# EasyEDA Pro project ProPrj_PA_SWITCH_V4_2026-02-15.epro

# Schematic Main_Schematic

## Sheets
1 MCU_POWER: Board Name: MAIN_PANEL; Create Date: 2025-02-24; Page Name: MCU_POWER; Project Name: PA_SWITCH_V4; Schematic Name: Main_Schematic; Update Date: 2025-05-14; Company: EasyEDA.com; Page Size: A4; Version: V1.0
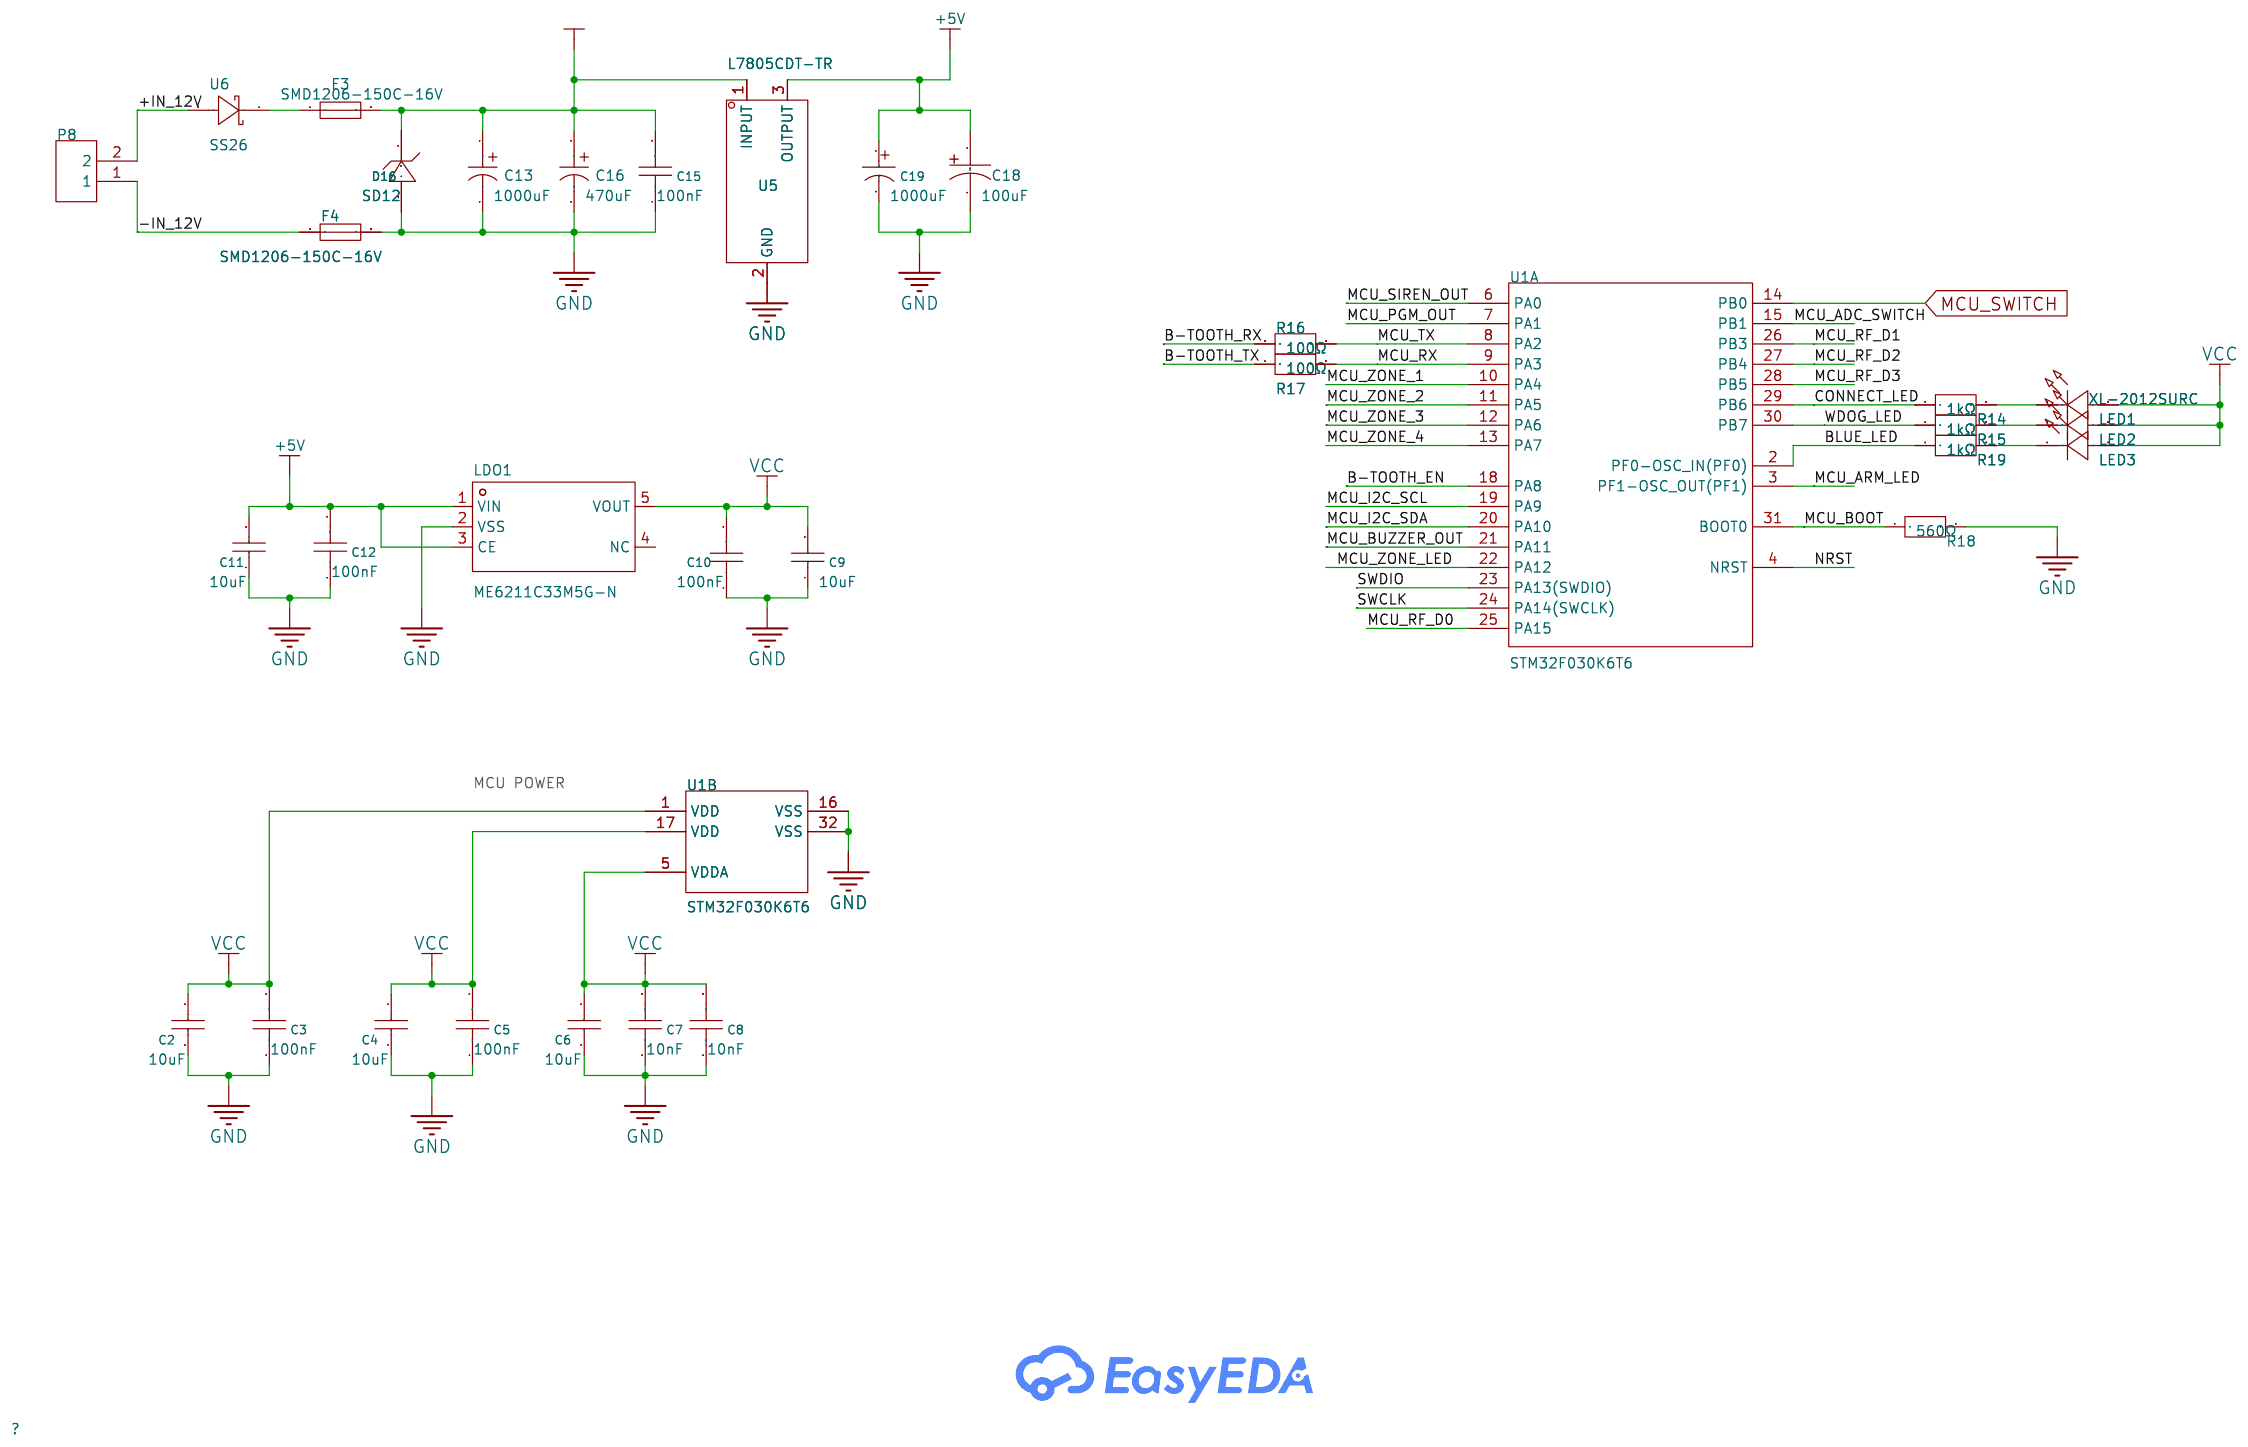
[diagram p0: MCU_POWER]
2 INPUTS_OUTPUTS: Page Name: INPUTS_OUTPUTS
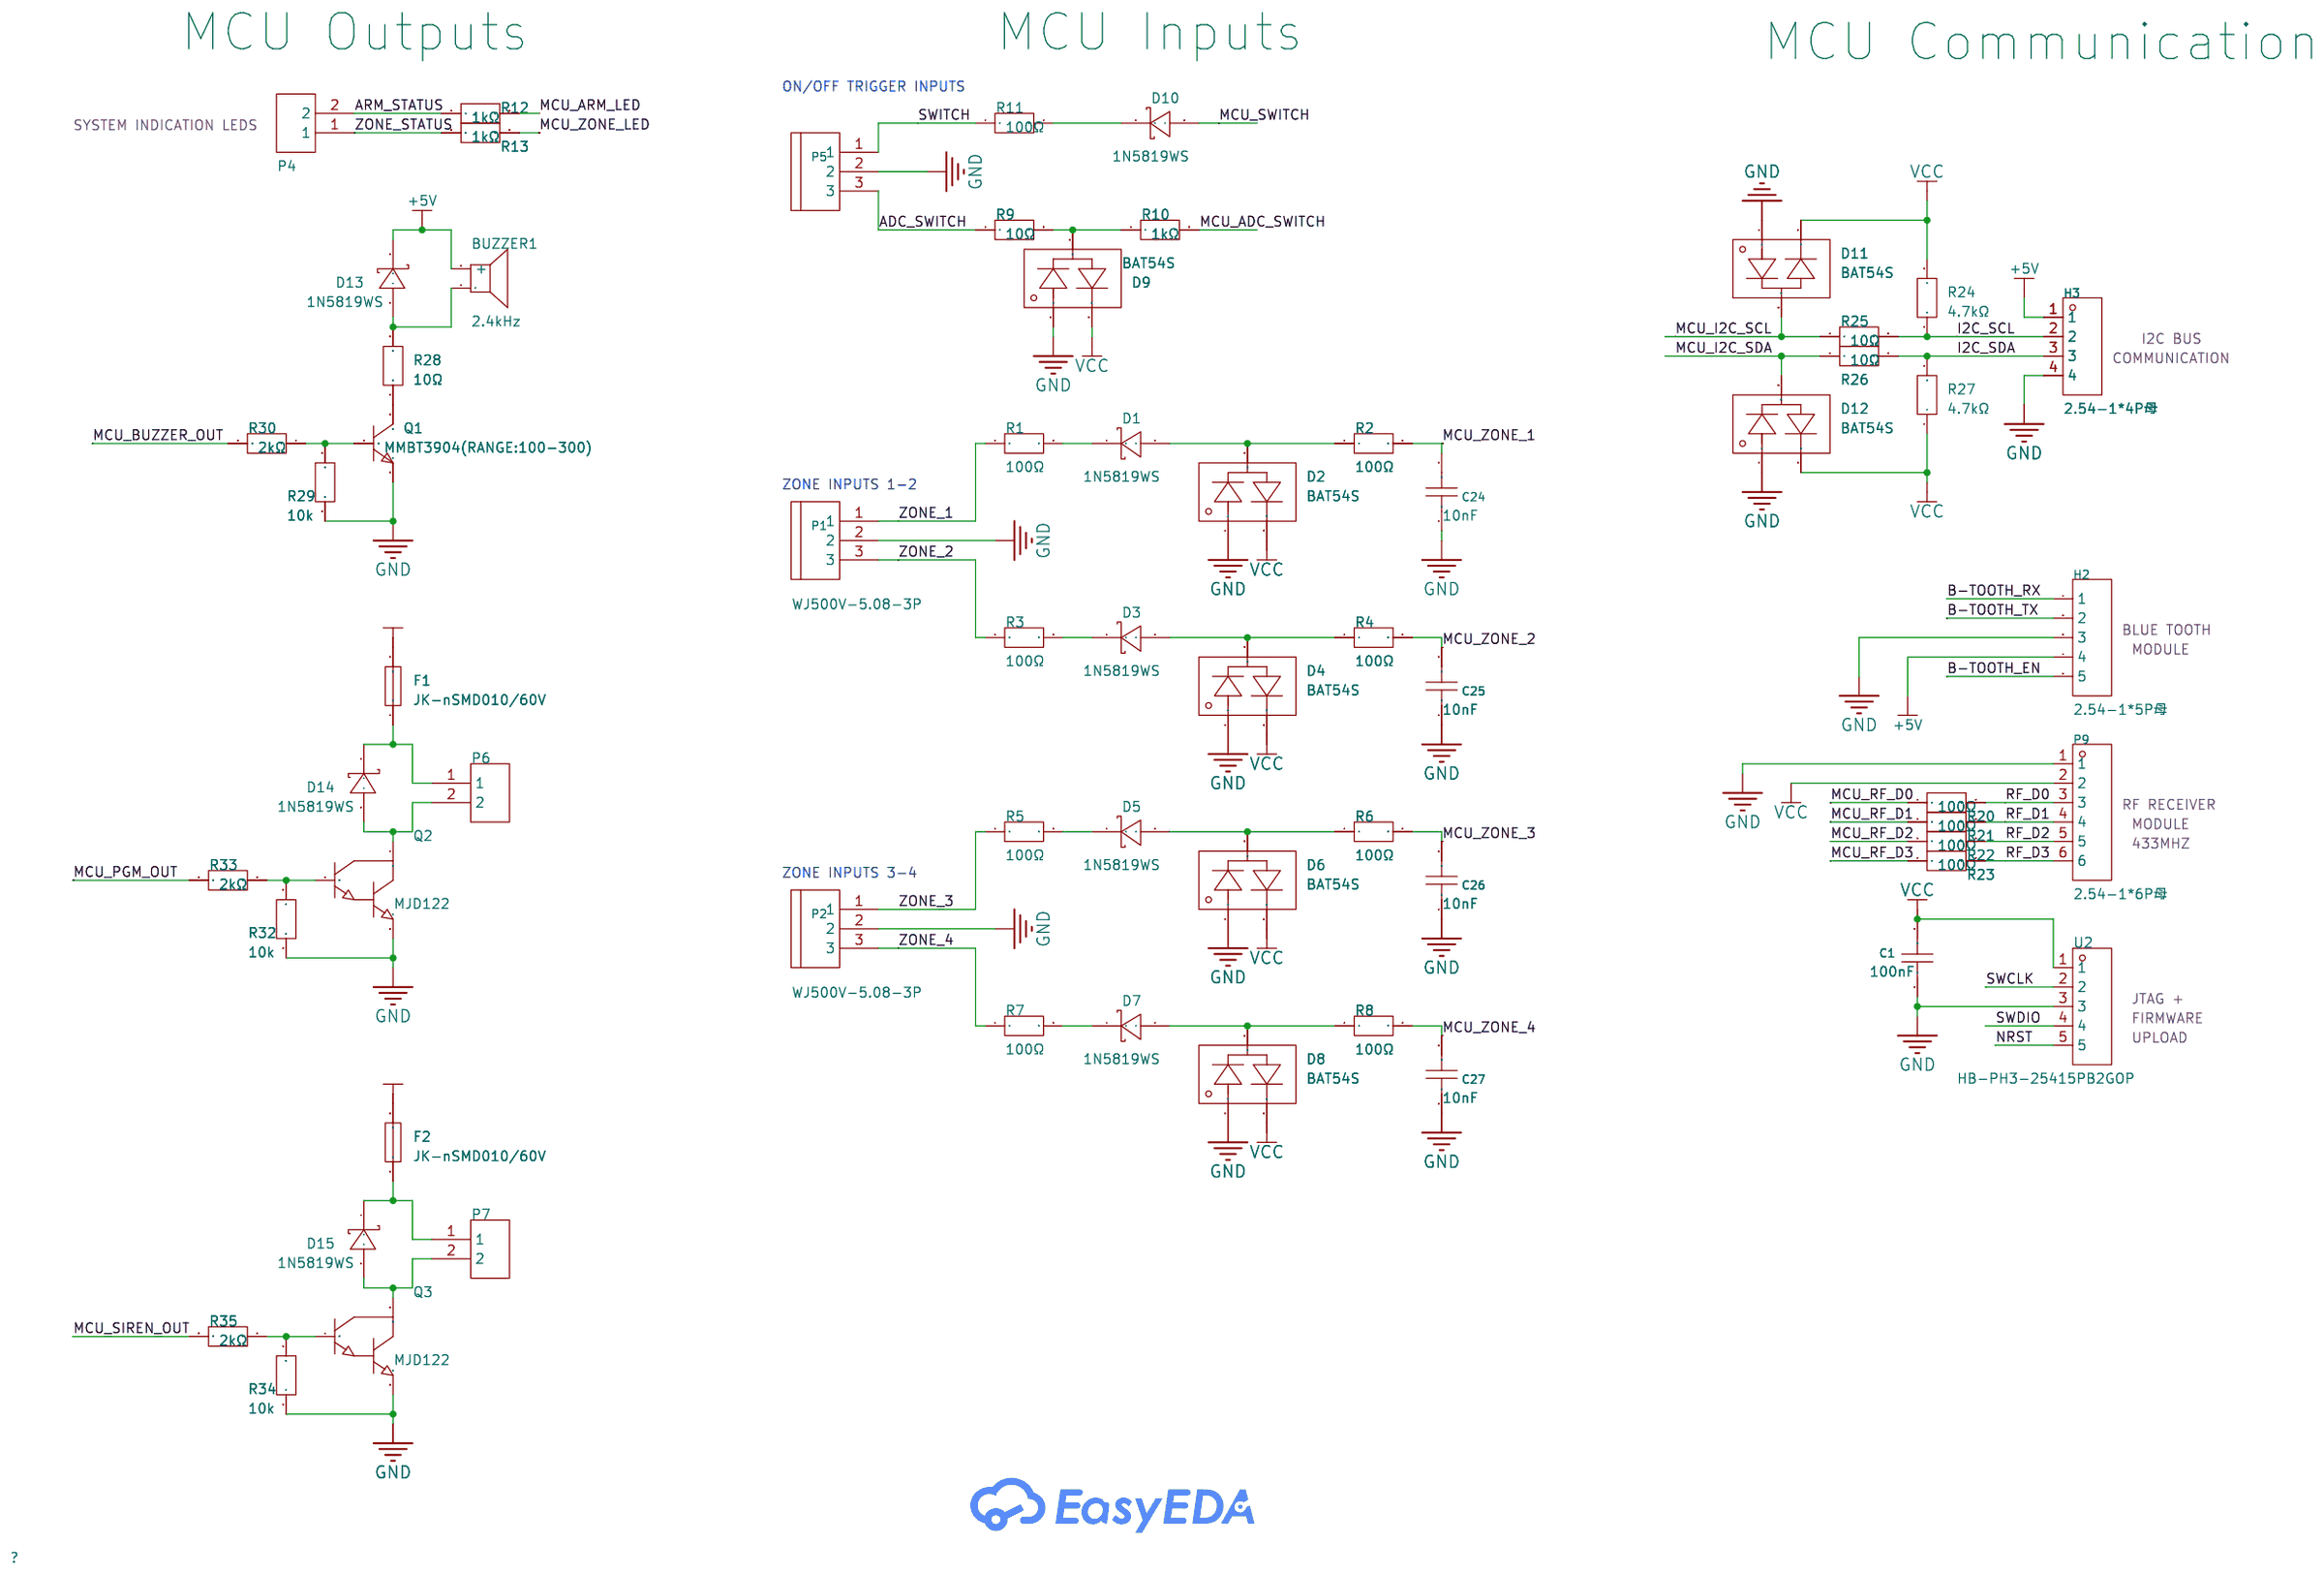
[diagram p1: INPUTS_OUTPUTS]

## Parts
sheet INPUTS_OUTPUTS
BUZZER1  2.4kHz  [BUZ-TH_BD12.0-P7.60-D0.6-FD]
C1  100nF  [C0603]
C24  10nF  [C0603]
C25  10nF  [C0603]
C26  10nF  [C0603]
C27  10nF  [C0603]
D1  1N5819WS  [SOD-323_L1.8-W1.3-LS2.5-RD]
D2  BAT54S  [SOT-23-3_L2.9-W1.3-P1.90-LS2.4-BR]
D3  1N5819WS  [SOD-323_L1.8-W1.3-LS2.5-RD]
D4  BAT54S  [SOT-23-3_L2.9-W1.3-P1.90-LS2.4-BR]
D5  1N5819WS  [SOD-323_L1.8-W1.3-LS2.5-RD]
D6  BAT54S  [SOT-23-3_L2.9-W1.3-P1.90-LS2.4-BR]
D7  1N5819WS  [SOD-323_L1.8-W1.3-LS2.5-RD]
D8  BAT54S  [SOT-23-3_L2.9-W1.3-P1.90-LS2.4-BR]
D9  BAT54S  [SOT-23-3_L2.9-W1.3-P1.90-LS2.4-BR]
D10  1N5819WS  [SOD-323_L1.8-W1.3-LS2.5-RD]
D11  BAT54S  [SOT-23-3_L2.9-W1.3-P1.90-LS2.4-BR]
D12  BAT54S  [SOT-23-3_L2.9-W1.3-P1.90-LS2.4-BR]
D13  1N5819WS  [SOD-323_L1.8-W1.3-LS2.5-RD]
D14  1N5819WS  [SOD-323_L1.8-W1.3-LS2.5-RD]
D15  1N5819WS  [SOD-323_L1.8-W1.3-LS2.5-RD]
F1  JK-nSMD010/60V  [F1206]
F2  JK-nSMD010/60V  [F1206]
H2  2.54-1*5P母  [HDR-TH_5P-P2.54-V-F]
H3  2.54-1*4P母  [HDR-TH_4P-P2.54-V-F]
P1  WJ500V-5.08-3P  [CONN-TH_3P-P5.00_WJ500V-5.08-3P]
P2  WJ500V-5.08-3P  [CONN-TH_3P-P5.00_WJ500V-5.08-3P]
P4  WJ500V-5.08-2P  [CONN-TH_2P-P5.00_WJ500V-5.08-2P]
P5  WJ500V-5.08-3P  [CONN-TH_3P-P5.00_WJ500V-5.08-3P]
P6  WJ500V-5.08-2P  [CONN-TH_2P-P5.00_WJ500V-5.08-2P]
P7  WJ500V-5.08-2P  [CONN-TH_2P-P5.00_WJ500V-5.08-2P]
P9  2.54-1*6P母  [HDR-TH_6P-P2.54-V-F]
Q1  MMBT3904(RANGE:100-300)  [SOT-23-3_L2.9-W1.3-P1.90-LS2.4-BR]
Q2  MJD122  [TO-252-3_L6.6-W6.1-P4.57-LS9.9-BR-CW]
Q3  MJD122  [TO-252-3_L6.6-W6.1-P4.57-LS9.9-BR-CW]
R1  100Ω  [R0603]
R2  100Ω  [R0603]
R3  100Ω  [R0603]
R4  100Ω  [R0603]
R5  100Ω  [R0603]
R6  100Ω  [R0603]
R7  100Ω  [R0603]
R8  100Ω  [R0603]
R9  10Ω  [R0603]
R10  1kΩ  [R0603]
R11  100Ω  [R0603]
R12  1kΩ  [R0603]
R13  1kΩ  [R0603]
R20  100Ω  [R0603]
R21  100Ω  [R0603]
R22  100Ω  [R0603]
R23  100Ω  [R0603]
R24  4.7kΩ  [R0603]
R25  10Ω  [R0603]
R26  10Ω  [R0603]
R27  4.7kΩ  [R0603]
R28  10Ω  [R0603]
R29  10kΩ  [R0603]
R30  2kΩ  [R0603]
R32  10kΩ  [R0603]
R33  2kΩ  [R0603]
R34  10kΩ  [R0603]
R35  2kΩ  [R0603]
U2  HB-PH3-25415PB2GOP  [HDR-TH_5P-P2.54-V-M]
sheet MCU_POWER
C2  10uF  [C0603]
C3  100nF  [C0603]
C4  10uF  [C0603]
C5  100nF  [C0603]
C6  10uF  [C0603]
C7  10nF  [C0603]
C8  10nF  [C0603]
C9  10uF  [C0603]
C10  100nF  [C0603]
C11  10uF  [C0603]
C12  100nF  [C0603]
C13  1000uF  [CAP-TH_BD10.0-P5.00-D0.6-FD]
C15  100nF  [C0603]
C16  470uF  [CAP-TH_BD8.0-P3.50-D0.6-FD_1]
C18  100uF  [CAP-TH_BD5.0-P2.00-D0.8-FD]
C19  1000uF  [CAP-TH_BD8.0-P3.50-D0.6-FD]
D16  SD12  [SOD-323_L1.7-W1.3-LS2.7-RD]
F3  SMD1206-150C-16V  [F1206]
F4  SMD1206-150C-16V  [F1206]
LDO1  ME6211C33M5G-N  [SOT-23-5_L3.0-W1.7-P0.95-LS2.8-BL]
LED1  XL-2012SURC  [LED0805-R-RD]
LED2  XL-2012UGC  [LED0805-RD_GREEN]
LED3  XL-2012UGC  [LED0805-RD_GREEN]
P8  WJ500V-5.08-2P  [CONN-TH_2P-P5.00_WJ500V-5.08-2P]
R14  1kΩ  [R0603]
R15  1kΩ  [R0603]
R16  100Ω  [R0603]
R17  100Ω  [R0603]
R18  560Ω  [R0603]
R19  1kΩ  [R0603]
U1  STM32F030K6T6  [TQFP-32_L7.0-W7.0-P0.50-BL]  (sections 1,2)
U5  L7805CDT-TR  [TO-252-3_L6.5-W5.8-P4.58-BL]
U6  SS26  [SMA_L4.3-W2.6-LS5.1-RD]

## Library data of the parts
BUZZER1 = TMB12A05: Driver Circuitry:Active (Built-in Driver Circuit) Technology:Electromagnetic Type Voltage Rating:- Voltage - Supply:4V~8V Voltage - Supply:4V~8V Frequency:2.4kHz Current Consumption:- Sound Pressure Level(SPL):85dB Diameter(φD):12mm Length:- Width:- Heigh; Supplier Part: C96093; Manufacturer: 华能; Supplier Footprint: 插件,D=12mm; JLCPCB Part Class: Extended Part; Datasheet: https://atta.szlcsc.com/upload/public/pdf/source/20241025/8A17FE04D767D19A35A06DEF9A82AB1E.pdf; Supplier: LCSC; Driver Circuitry: Active (Built-in Driver Circuit); Technology: Electromagnetic Type; Voltage - Supply: 4V~8V; Sound Pressure Level(SPL): 85dB; Diameter(φD): 12mm; Height: 9.8mm
C1 C3 C5 C7 C8 C10 C12 C15 C24-C27 = CC0603KRX7R9BB104: Capacitance: Tolerance:±10% Tolerance:±10% Voltage Rated: Temperature Coefficient:; LCSC Part Name: 100nF ±10% 50V; Supplier Part: C14663; Manufacturer: YAGEO(国巨); Supplier Footprint: 0603; JLCPCB Part Class: Basic Part; Datasheet: https://atta.szlcsc.com/upload/public/pdf/source/20180910/C282072_33301C7F631E79921B82A8DAC6BCC5B3.pdf; Supplier: LCSC; Tolerance: ±10%
D1 D3 D5 D7 D10 D13-D15 = 1N5819WS_C191023: Forward Voltage (Vf@If):600mV@1A Reverse Voltage (Vr):40V Rectified Current:1A; LCSC Part Name: 电压:40V 电流:1A; Supplier Part: C191023; Manufacturer: Hottech(合科泰); Supplier Footprint: SOD-323; JLCPCB Part Class: Basic Part; Datasheet: https://atta.szlcsc.com/upload/public/pdf/source/20220428/3CB86FD8D28D653594B4E35F9D5AEFD9.pdf; Supplier: LCSC; Forward Voltage (Vf@If): 600mV@1A; Reverse Voltage (Vr): 40V; Rectified Current: 1A
D2 D4 D6 D8 D9 D11 D12 = BAT54S_C22368877: Supplier Part: C22368877; Manufacturer: Wild Goose(威谷); Supplier Footprint: SOT-23; JLCPCB Part Class: Extended Part; Datasheet: https://atta.szlcsc.com/upload/public/pdf/source/20240415/16A09F7740832A26F61AD411826615C5.pdf; Supplier: LCSC
F1 F2 = JK-nSMD010/60V: Operating Voltage (Max):60V Current Rating (Max):100A Hold Current:100mA Trip Current:250mA Power Dissipation:- Resistance - Initial (Ri) (Min):1.6Ω Resistance - Post Trip (R1) (Max):15Ω Maximum Time to Trip:1s Operating Temperature:-40℃~+85℃ Operating Te; LCSC Part Name: 100mA 60V; Supplier Part: C2830236; Manufacturer: JK(金科); Supplier Footprint: 1206; JLCPCB Part Class: Extended Part; Datasheet: https://atta.szlcsc.com/upload/public/pdf/source/20210427/C2830251_B9511B640A50AD6A91174E2DDDD254CA.pdf; Supplier: LCSC; Operating Voltage (Max): 60V; Current Rating (Max): 100A; Hold Current: 100mA; Trip Current: 250mA; Resistance - Initial (Ri) (Min): 1.6Ω; Resistance - Post Trip (R1) (Max): 15Ω; Maximum Time to Trip: 1s; Operating Temperature: -40℃~+85℃
H2 = 2.54-1*5P母: Holes Structure:1x5P Pitch:2.54mm Row Spacing:- Mounting Type:Straight Number of Rows:Plugin Number of Holes:5P Insulation Height:- Contact Material:- Contact Plating:-; LCSC Part Name: 间距:2.54mm 1x5P 直插; Supplier Part: C50950; Manufacturer: BOOMELE(博穆精密); Supplier Footprint: 插件,P=2.54mm; JLCPCB Part Class: Extended Part; Datasheet: https://atta.szlcsc.com/upload/public/pdf/source/20210301/C2718488_F4427B881E42CAA8DDB0B1C12B3A522C.pdf; Supplier: LCSC; Holes Structure: 1x5P; Pitch: 2.54mm; Mounting Type: Straight; Number of Rows: Plugin; Number of Holes: 5P
H3 = 2.54-1*4P母: Holes Structure:1x4P Pitch:2.54mm Row Spacing:- Circular Hole / Square Hole:Square Holes Mounting Type:Straight Number of Rows:Plugin Number of Holes:4P Current Rating (Max):3A Voltage Rating (Max):- Holes Direction:Top Insulation Height:- Contact Materia; LCSC Part Name: 间距:2.54mm 1x4P 直插; Supplier Part: C2718488; Manufacturer: BOOMELE(博穆精密); Supplier Footprint: 插件,P=2.54mm; JLCPCB Part Class: Extended Part; Datasheet: https://atta.szlcsc.com/upload/public/pdf/source/20210301/C2718488_F4427B881E42CAA8DDB0B1C12B3A522C.pdf; Supplier: LCSC; Holes Structure: 1x4P; Pitch: 2.54mm; Circular Hole / Square Hole: Square Holes; Mounting Type: Straight; Number of Rows: Plugin; Number of Holes: 4P; Current Rating (Max): 3A; Holes Direction: Top; Contact Material: bronze; Operating Temperature Range: -40℃~+105℃
P1 P2 P5 = WJ500V-5.08-3P: Structure:1x3P Pitch:5.08mm Color:Green Mounting Style:Straight Current Rating (Max):18A Voltage Rating (Max):250V Number of Pins:3P Number of Rows:1 Wire Gauge - AWG:14~30 Wire Gauge - AWG:14~30 Wire Gauge - mm2:2.5 Wire Gauge - mm2:2.5 Number of PINs Pe; LCSC Part Name: 5.08mm 1x3P 排数:1 每排P数:3 直插; Supplier Part: C72334; Manufacturer: KANGNEX(康奈克斯电气); Supplier Footprint: 插件,P=5.08mm; JLCPCB Part Class: Extended Part; Datasheet: https://atta.szlcsc.com/upload/public/pdf/source/20191225/C72334_8A5EF831D67650233B6B1E3F2BC06274.pdf; Supplier: LCSC; Structure: 1x3P; Pitch: 5.08mm; Color: Green; Mounting Style: Straight; Current Rating (Max): 18A; Voltage Rating (Max): 250V; Number of Pins: 3P; Number of Rows: 1; Wire Gauge - AWG: 14~30; Wire Gauge - mm2: 2.5; Number of PINs Per Row: 3; Operating Temperature Range: -40℃~+105℃
P4 P6-P8 = WJ500V-5.08-2P: Structure:1x2P Pitch:5.08mm Color:Green Mounting Style:Direct Insert Current Rating (Max):18A Voltage Rating (Max):250V Number of Pins:2P Number of Rows:1 Wire Gauge - AWG:14~30 Wire Gauge - AWG:14~30 Wire Gauge - mm2:2.5 Wire Gauge - mm2:2.5 Number of PI; LCSC Part Name: 1x2P 5.08mm 直插 排数:1 每排P数:2; Supplier Part: C8465; Manufacturer: KANGNEX(康奈克斯电气); Supplier Footprint: 插件,P=5.08mm; JLCPCB Part Class: Extended Part; Datasheet: https://atta.szlcsc.com/upload/public/pdf/source/20191225/C8465_02D34CE5B5B4A53DF5891601D97FA9F4.pdf; Supplier: LCSC; Structure: 1x2P; Pitch: 5.08mm; Color: Green; Mounting Style: Direct Insert; Current Rating (Max): 18A; Voltage Rating (Max): 250V; Number of Pins: 2P; Number of Rows: 1; Wire Gauge - AWG: 14~30; Wire Gauge - mm2: 2.5; Number of PINs Per Row: 2; Operating Temperature Range: -40℃~+105℃; Screw Specification: M2.5
P9 = 2.54-1*6P母: Holes Structure:1x6P Pitch:2.54mm Row Spacing:- Mounting Type:Straight Number of Rows:Plugin Number of Holes:6P Insulation Height:- Contact Material:- Contact Plating:-; LCSC Part Name: 间距:2.54mm 1x6P 直插; Supplier Part: C40877; Manufacturer: BOOMELE(博穆精密); Supplier Footprint: 插件,P=2.54mm; JLCPCB Part Class: Extended Part; Datasheet: https://atta.szlcsc.com/upload/public/pdf/source/20210301/C2718488_F4427B881E42CAA8DDB0B1C12B3A522C.pdf; Supplier: LCSC; Holes Structure: 1x6P; Pitch: 2.54mm; Mounting Type: Straight; Number of Rows: Plugin; Number of Holes: 6P
Q1 = MMBT3904(RANGE:100-300): Transistor Type: Collector Current (Ic): Collector-Emitter Breakdown Voltage (Vceo): Power Dissipation (Pd): DC Current Gain (hFE@Ic,Vce):100@10mA,1V DC Current Gain (hFE@Ic,Vce):100@10mA,1V Transition Frequency (fT):300MHz Collector Cut-Off Current (Icbo; LCSC Part Name: NPN 电流:200mA 耐压:40V hfe=100~300; Supplier Part: C20526; Manufacturer: CJ(江苏长电/长晶); Supplier Footprint: SOT-23; JLCPCB Part Class: Basic Part; Datasheet: https://atta.szlcsc.com/upload/public/pdf/source/20220704/70F575FB75061E03F919270A6BB8BA7F.pdf; Supplier: LCSC; DC Current Gain (hFE@Ic,Vce): 100@10mA,1V; Transition Frequency (fT): 300MHz; Collector Cut-Off Current (Icbo): 100nA; Collector-Emitter Saturation Voltage (VCE(sat)@Ic,Ib): 300mV@50mA,5mA
Q2 Q3 = MJD122_C59488: Supplier Part: C59488; Manufacturer: CJ(江苏长电/长晶); Supplier Footprint: TO-252-2(DPAK); JLCPCB Part Class: Extended Part; Datasheet: https://atta.szlcsc.com/upload/public/pdf/source/20230302/E6FC91296A9A3DD0AA86197AAF35A876.pdf; Supplier: LCSC
R1-R8 R11 R16 R17 R20-R23 = CR0603FA1000G_C100700: Type:Thick Film Resistors Resistance: Tolerance:±1% Tolerance:±1% Power(Watts): Overload Voltage (Max): Temperature Coefficient:±100ppm/℃ Temperature Coefficient:±100ppm/℃ Operating Temperature Range:-55℃~+125℃ Operating Temperature Range:-55℃~+125℃; LCSC Part Name: 厚膜电阻 100Ω ±1% 100mW; Supplier Part: C100700; Manufacturer: LIZ(丽智电子); Manufacturer Part: CR0603FA1000G; Supplier Footprint: 0603; JLCPCB Part Class: Extended Part; Datasheet: https://atta.szlcsc.com/upload/public/pdf/source/20180403/C189438_6D658388CC7843F35BBC9018D03F0B8E.pdf; Supplier: LCSC; Type: Thick Film Resistors; Tolerance: ±1%; Temperature Coefficient: ±100ppm/℃; Operating Temperature Range: -55℃~+125℃
R9 R25 R26 R28 = SCR0603J10R: Type:Thick Film Resistors Resistance: Tolerance:±5% Tolerance:±5% Power(Watts): Overload Voltage (Max): Operating Temperature Range:-55℃~+155℃ Operating Temperature Range:-55℃~+155℃; LCSC Part Name: 厚膜电阻 10Ω ±5% 100mW; Supplier Part: C3017781; Manufacturer: VO(翔胜); Supplier Footprint: 0603; JLCPCB Part Class: Extended Part; Datasheet: https://atta.szlcsc.com/upload/public/pdf/source/20220513/247AF9639BA21CF93567DC289CCC6A22.pdf; Supplier: LCSC; Type: Thick Film Resistors; Tolerance: ±5%; Operating Temperature Range: -55℃~+155℃
R10 R12-R15 R19 = SCR0603J1K: Type:Thick Film Resistors Resistance: Tolerance:±5% Tolerance:±5% Power(Watts): Overload Voltage (Max): Operating Temperature Range:-55℃~+155℃ Operating Temperature Range:-55℃~+155℃; LCSC Part Name: 厚膜电阻 1kΩ ±5% 100mW; Supplier Part: C3017736; Manufacturer: VO(翔胜); Supplier Footprint: 0603; JLCPCB Part Class: Extended Part; Datasheet: https://atta.szlcsc.com/upload/public/pdf/source/20220513/247AF9639BA21CF93567DC289CCC6A22.pdf; Supplier: LCSC; Type: Thick Film Resistors; Tolerance: ±5%; Operating Temperature Range: -55℃~+155℃
R24 R27 = CR0603FA4701G: Type:Thick Film Resistors Resistance: Tolerance:±1% Tolerance:±1% Power(Watts): Overload Voltage (Max): Temperature Coefficient:±100ppm/℃ Temperature Coefficient:±100ppm/℃ Operating Temperature Range:-55℃~+125℃ Operating Temperature Range:-55℃~+125℃; LCSC Part Name: 厚膜电阻 4.7kΩ ±1% 100mW; Supplier Part: C101062; Manufacturer: LIZ(丽智电子); Supplier Footprint: 0603; JLCPCB Part Class: Extended Part; Datasheet: https://atta.szlcsc.com/upload/public/pdf/source/20180403/C189438_6D658388CC7843F35BBC9018D03F0B8E.pdf; Supplier: LCSC; Type: Thick Film Resistors; Tolerance: ±1%; Temperature Coefficient: ±100ppm/℃; Operating Temperature Range: -55℃~+125℃
R29 R32 R34 = FRC0603J103TS: Type:Thick Film Resistors Resistance:10kΩ Tolerance:±5% Tolerance:±5% Power(Watts): Overload Voltage (Max): Temperature Coefficient:±100ppm/℃ Temperature Coefficient:±100ppm/℃ Operating Temperature Range:-55℃~+155℃ Operating Temperature Range:-55℃~+155℃; LCSC Part Name: 10kΩ ±5% 100mW 厚膜电阻; Supplier Part: C2930027; Manufacturer: FOJAN(富捷); Supplier Footprint: 0603; JLCPCB Part Class: Extended Part; Datasheet: https://atta.szlcsc.com/upload/public/pdf/source/20211221/925EC7D7225764EE0046F22065062C87.pdf; Supplier: LCSC; Type: Thick Film Resistors; Tolerance: ±5%; Temperature Coefficient: ±100ppm/℃; Operating Temperature Range: -55℃~+155℃
R30 R33 R35 = SCR0603F2K: Type:Thick Film Resistors Resistance:2kΩ Tolerance:±1% Tolerance:±1% Power(Watts): Overload Voltage (Max): Operating Temperature Range:-55℃~+155℃ Operating Temperature Range:-55℃~+155℃; LCSC Part Name: 厚膜电阻 2kΩ ±1% 100mW; Supplier Part: C3016472; Manufacturer: VO(翔胜); Supplier Footprint: 0603; JLCPCB Part Class: Extended Part; Datasheet: https://atta.szlcsc.com/upload/public/pdf/source/20220513/247AF9639BA21CF93567DC289CCC6A22.pdf; Supplier: LCSC; Type: Thick Film Resistors; Tolerance: ±1%; Operating Temperature Range: -55℃~+155℃
U2 = HB-PH3-25415PB2GOP: Pin Structure:1x5P Pitch:2.54mm Row Spacing:2.54mm Circluar Pins/Square Pins:Square Pins Mounting Type:Straight Number of Rows:Plugin Number of Pins:5P Current Rating (Max):3A Voltage Rating (Max):250V Length of Mating Pin:6mm Insulation Height:2.54mm Len; LCSC Part Name: 间距:2.54mm 1x5P 直插 方针; Supplier Part: C6332198; Manufacturer: HANBO(汉博); Supplier Footprint: 插件,P=2.54mm; JLCPCB Part Class: Extended Part; Datasheet: https://atta.szlcsc.com/upload/public/pdf/source/20230803/F72D259687963761DF1B552F3BB84A31.pdf; Supplier: LCSC; Pin Structure: 1x5P; Pitch: 2.54mm; Row Spacing: 2.54mm; Circluar Pins/Square Pins: Square Pins; Mounting Type: Straight; Number of Rows: Plugin; Number of Pins: 5P; Current Rating (Max): 3A; Voltage Rating (Max): 250V; Length of Mating Pin: 6mm; Insulation Height: 2.54mm; Length of End Connection Pin: 3mm; Contact Plating: Gold; Operating Temperature Range: -40℃~+105℃; Soldering Temperature(Max): 260℃; Color: Black
C2 C4 C6 C9 C11 = GRM188R60J106ME47D: Capacitance: Tolerance:±20% Tolerance:±20% Voltage Rated: Temperature Coefficient:; LCSC Part Name: 10uF ±20% 6.3V; Supplier Part: C77041; Manufacturer: muRata(村田); Supplier Footprint: 0603; JLCPCB Part Class: Extended Part; Datasheet: https://atta.szlcsc.com/upload/public/pdf/source/20200305/C490387_23319AE8C154DEB24C505E6C82A8106A.pdf; Supplier: LCSC; Tolerance: ±20%
C13 = CD2881081EM1017VFL: Capacitance: Rated Voltage:; LCSC Part Name: 1000uF 25V; Supplier Part: C7493865; Manufacturer: HRK(鸿瑞凯电子); Supplier Footprint: 插件,D10xL17mm; JLCPCB Part Class: Extended Part; Supplier: LCSC
C16 = CD2884771EM0812VFL: Capacitance: Rated Voltage: φD: L: Operating Temperature:-40℃~+105℃ Operating Temperature:-40℃~+105℃; LCSC Part Name: 470uF 25V; Supplier Part: C2960233; Manufacturer: HRK(鸿瑞凯电子); Supplier Footprint: 插件,D8xL12mm; JLCPCB Part Class: Extended Part; Datasheet: https://atta.szlcsc.com/upload/public/pdf/source/20240703/D49961C1CEC6E325964F7113D69E9087.pdf; Supplier: LCSC; Operating Temperature: -40℃~+105℃
C18 = REA101M1ABK-0511P: Capacitance: Tolerance:±20% Tolerance:±20% Voltage Rated: Lead Spacing: Diameter: Height - Seated (Max): Lifetime @ Temp:2000hrs@85℃; LCSC Part Name: 100uF ±20% 10V; Supplier Part: C134526; Manufacturer: lelon(立隆); Supplier Footprint: 插件,D5xL11mm; JLCPCB Part Class: Extended Part; Datasheet: https://atta.szlcsc.com/upload/public/pdf/source/20171023/C134536_15087453839261052607.pdf; Supplier: LCSC; Tolerance: ±20%; Lifetime @ Temp: 2000hrs@85℃
C19 = GR108M010F12RR0VL4FP0: Capacitance:1000uF Tolerance:±20% Tolerance:±20% Rated Voltage: Ripple Current:640mA@100kHz Equivalent Series Resistance(ESR):- Lead Spacing: φD: L: Lifetime @ Temp:3000hrs@105℃ Operating Temperature:-40℃~+105℃ Operating Temperature:-40℃~+105℃; LCSC Part Name: 1000uF ±20% 10V 绿色; Supplier Part: C3299; Manufacturer: CX(承兴); Supplier Footprint: 插件,D8xL12mm; JLCPCB Part Class: Extended Part; Datasheet: https://atta.szlcsc.com/upload/public/pdf/source/20211027/ED0DA65C69F42D9BDEC91091BA4C03CD.pdf; Supplier: LCSC; Tolerance: ±20%; Ripple Current: 640mA@100kHz; Lifetime @ Temp: 3000hrs@105℃; Operating Temperature: -40℃~+105℃
D16 = SD12: polarity:Unidirectional Reverse Stand-Off Voltage (Vrwm):12V Maximum Clamping Voltage:32V Peak Pulse Current (Ipp)@10/1000us:11A Peak Pulse Power Dissipation (Ppp)@10/1000us:350W Breakdown Voltage:13.3V Reverse Leakage Current (Ir):1uA Type:ESD; LCSC Part Name: 350W 13.3V ESD管; Supplier Part: C502528; Manufacturer: MDD; Supplier Footprint: SOD-323; JLCPCB Part Class: Extended Part; Datasheet: https://atta.szlcsc.com/upload/public/pdf/source/20230823/A4FB82CF4063F527BA646C80DC150D6A.pdf; Supplier: LCSC; polarity: Unidirectional; Reverse Stand-Off Voltage (Vrwm): 12V; Maximum Clamping Voltage: 32V; Peak Pulse Current (Ipp)@10/1000us: 11A; Peak Pulse Power Dissipation (Ppp)@10/1000us: 350W; Breakdown Voltage: 13.3V; Reverse Leakage Current (Ir): 1uA; Type: ESD
F3 F4 = SMD1206-150C-16V: Operating Voltage (Max):16V Current Rating (Max):50A Hold Current:1.5A Trip Current:3A Power Dissipation:800mW Resistance - Initial (Ri) (Min):25mΩ Resistance - Post Trip (R1) (Max):130mΩ Maximum Time to Trip:300ms Operating Temperature:-40℃~+85℃ Operatin; LCSC Part Name: 16V 1.5A 1206自恢复; Supplier Part: C2760275; Manufacturer: BNstar(比诺星); Supplier Footprint: 1206; JLCPCB Part Class: Extended Part; Datasheet: https://atta.szlcsc.com/upload/public/pdf/source/20210322/C2760275_F854F382E91EAE0EDC060F2511C0775A.pdf; Supplier: LCSC; Operating Voltage (Max): 16V; Current Rating (Max): 50A; Hold Current: 1.5A; Trip Current: 3A; Power Dissipation: 800mW; Resistance - Initial (Ri) (Min): 25mΩ; Resistance - Post Trip (R1) (Max): 130mΩ; Maximum Time to Trip: 300ms; Operating Temperature: -40℃~+85℃
LDO1 = ME6211C33M5G-N: Output Type: Maximum Input Voltage:6V Output Voltage:3.3V Output Voltage:3.3V MAX Output Current:500mA Power Supply Rejection Ratio (PSRR):70dB Dropout Voltage:260mV@(200mA) Output Polarity:Positive electrode Number of Outputs:1; LCSC Part Name: 输入6V 输出3.3V 500mA; Supplier Part: C82942; Manufacturer: MICRONE(南京微盟); Supplier Footprint: SOT-23-5; JLCPCB Part Class: Extended Part; Datasheet: https://atta.szlcsc.com/upload/public/pdf/source/20170918/C82942_1505727073070976520.pdf; Supplier: LCSC; Maximum Input Voltage: 6V; Output Voltage: 3.3V; MAX Output Current: 500mA; Power Supply Rejection Ratio (PSRR): 70dB; Dropout Voltage: 260mV@(200mA); Output Polarity: Positive electrode; Number of Outputs: 1
LED1 = XL-2012SURC: Emitted Color:Red Power Dissipation:55mW Forward Current:25mA Dominant Wavelength:617nm~621nm Dominant Wavelength:617nm~621nm Peak Wavelength:623nm Lens Color:无色透明透镜 Color Temperature:- Color Temperature:- Viewing Angle:120° Mounting Sytle:Positive post O; Supplier Part: C965812; Manufacturer: XINGLIGHT(成兴光); Supplier Footprint: 0805; JLCPCB Part Class: Extended Part; Datasheet: https://atta.szlcsc.com/upload/public/pdf/source/20221102/49E1A0A365644091E6270AF1C5E0FE37.pdf; Supplier: LCSC; Emitted Color: Red; Power Dissipation: 55mW; Forward Current: 25mA; Dominant Wavelength: 617nm~621nm; Peak Wavelength: 623nm; Lens Color: 无色透明透镜; Viewing Angle: 120°; Mounting Sytle: Positive post; Operating Temperature: -30℃~+85℃
LED2 LED3 = XL-2012UGC: Emitted Color:Emerald Forward Voltage (VF):3.2V Forward Voltage (VF):3.2V Power Dissipation:70mW Forward Current:20mA Dominant Wavelength:515nm~535nm Dominant Wavelength:515nm~535nm Peak Wavelength:525nm Lens Color:Colorless transparent lens Color Tempera; Supplier Part: C965815; Manufacturer: XINGLIGHT(成兴光); Supplier Footprint: 0805; JLCPCB Part Class: Extended Part; Datasheet: https://atta.szlcsc.com/upload/public/pdf/source/20240218/10747BE0D5713A87F194700A6CFFD889.pdf; Supplier: LCSC; Emitted Color: Emerald; Forward Voltage (VF): 3.2V; Power Dissipation: 70mW; Forward Current: 20mA; Dominant Wavelength: 515nm~535nm; Peak Wavelength: 525nm; Lens Color: Colorless transparent lens; Luminous Intensity: 750mcd; Viewing Angle: 120°; Mounting Sytle: Positive Stick; Operating Temperature: -20℃~+85℃
R18 = AECR0603F560RK9: Type:Thick Film Resistors Resistance:560Ω Tolerance:±1% Tolerance:±1% Power(Watts):100mW Voltage-Supply(Max):50V Temperature Coefficient:±100ppm/℃ Temperature Coefficient:±100ppm/℃ Operating Temperature:-55℃~+155℃ Operating Temperature:-55℃~+155℃; LCSC Part Name: 车规级 厚膜电阻 560Ω ±1% 100mW; Supplier Part: C328369; Manufacturer: RESI(开步睿思); Supplier Footprint: 0603; JLCPCB Part Class: Extended Part; Datasheet: https://atta.szlcsc.com/upload/public/pdf/source/20181212/C352486_55819DC58ECB15BFA3B0F11121E3606D.pdf; Supplier: LCSC; Type: Thick Film Resistors; Tolerance: ±1%; Power(Watts): 100mW; Voltage-Supply(Max): 50V; Temperature Coefficient: ±100ppm/℃; Operating Temperature: -55℃~+155℃
U1 = STM32F030K6T6: CPU Core:ARM-M0 CPU Maximum Speed:48MHz Program Storage Size:32KB Program Memory Type:FLASH Number of I/O:26 ADC (Bit):12bit Low Voltage Detection Threshold:2.4V~3.6V Low Voltage Detection Threshold:2.4V~3.6V Application Area:-; LCSC Part Name: 主流ARM Cortex-M0超值系列MCU，具有32 KB Flash和48 MHz CPU; Supplier Part: C46830; Manufacturer: ST(意法半导体); Supplier Footprint: LQFP-32(7x7); JLCPCB Part Class: Extended Part; Datasheet: https://atta.szlcsc.com/upload/public/pdf/source/20161209/1481271865294.pdf; Supplier: LCSC; CPU Core: ARM-M0; CPU Maximum Speed: 48MHz; Program Storage Size: 32KB; Program Memory Type: FLASH; Number of I/O: 26; ADC (Bit): 12bit; Low Voltage Detection Threshold: 2.4V~3.6V
U5 = L7805CDT-TR: Output Type:Fixed Maximum Input Voltage:35V Output Voltage:5V Output Voltage:5V Output Current:1.5A Power Supply Rejection Ratio (PSRR):62dB@(120Hz) Dropout Voltage:2V@(1A) standby current:8mA Feature:Short-Circuit  Protection；Thermal Protection(TSD) Oper; LCSC Part Name: 正稳压器IC; Supplier Part: C310413; Manufacturer: ST(意法半导体); Supplier Footprint: DPAK; JLCPCB Part Class: Extended Part; Datasheet: https://atta.szlcsc.com/upload/public/pdf/source/20191219/C472632_C0855675BBC73B8C8E44EE1325AAD56A.pdf; Supplier: LCSC; Output Type: Fixed; Maximum Input Voltage: 35V; Output Voltage: 5V; Output Current: 1.5A; Power Supply Rejection Ratio (PSRR): 62dB@(120Hz); Dropout Voltage: 2V@(1A); standby current: 8mA; Feature: Short-Circuit  Protection；Thermal Protection(TSD); Operating Temperature: 0℃~+125℃; Output Polarity: Positive electrode; Number of Outputs: 1
U6 = SS26_C5350986: Diode Configuration:Single Forward Voltage (Vf@If):700mV Reverse Voltage (Vr):60V Average Rectified Current (Io):2A Reverse Leakage Current (Ir):500uA Peak forward surge current:50A; LCSC Part Name: 电压:60V 电流:2A; Supplier Part: C5350986; Manufacturer: ElecSuper(静芯微); Supplier Footprint: DO-214AC(SMA); JLCPCB Part Class: Extended Part; Datasheet: https://atta.szlcsc.com/upload/public/pdf/source/20230130/E25E41BB26D5A90710669769C75D8045.pdf; Supplier: LCSC; Diode Configuration: Single; Forward Voltage (Vf@If): 700mV; Reverse Voltage (Vr): 60V; Average Rectified Current (Io): 2A; Reverse Leakage Current (Ir): 500uA; Peak forward surge current: 50A

## Nets
+5V: BUZZER1.1(+) C11.2 C12.2 C18.1 C19.1 D13.1(K) H2.4 H3.1 LDO1.1(VIN) LDO1.3(CE) U5.3(OUTPUT)
+12V: C13.1 C15.2 C16.1 D16.1(C) F1.2 F2.2 F3.2 U5.1(INPUT)
GND: C1.1 C2.1 C3.1 C4.1 C5.1 C6.1 C7.1 C8.1 C9.1 C10.1 C11.1 C12.1 C13.2 C15.1 C16.2 C18.2 C19.2 C24.1 C25.1 C26.1 C27.1 D2.1 D4.1 D6.1 D8.1 D9.1 D11.1 D12.1 D16.2(A) F4.2 H2.3 H3.4 LDO1.2(VSS) P1.2 P2.2 P5.2 P9.1 Q1.2(E) Q2.3(E) Q3.3(E) R18.2 R29.1 R32.1 R34.1 U1.16(VSS) U1.32(VSS) U2.3 U5.2(GND)
VCC: C1.2 C2.2 C3.2 C4.2 C5.2 C6.2 C7.2 C8.2 C9.2 C10.2 D2.2 D4.2 D6.2 D8.2 D9.2 D11.2 D12.2 LDO1.5(VOUT) LED1.1(A) LED2.2(A) LED3.2(A) P9.2 R24.2 R27.1 U1.1(VDD) U1.5(VDDA) U1.17(VDD) U2.1
+IN_12V: P8.2 U6.2(A)
-IN_12V: F4.1 P8.1
ADC_SWITCH: P5.3 R9.1
ARM_STATUS: P4.2 R12.1
B-TOOTH_EN: H2.5 U1.18(PA8)
B-TOOTH_RX: H2.1 R16.1
B-TOOTH_TX: H2.2 R17.1
BLUE_LED: R19.1 U1.2(PF0-OSC_IN(PF0))
CONNECT_LED: R14.1 U1.29(PB6)
I2C_SCL: H3.2 R24.1 R25.2
I2C_SDA: H3.3 R26.2 R27.2
MCU_ADC_SWITCH: R10.2 U1.15(PB1)
MCU_ARM_LED: R12.2 U1.3(PF1-OSC_OUT(PF1))
MCU_BOOT: R18.1 U1.31(BOOT0)
MCU_BUZZER_OUT: R30.2 U1.21(PA11)
MCU_I2C_SCL: D11.3 R25.1 U1.19(PA9)
MCU_I2C_SDA: D12.3 R26.1 U1.20(PA10)
MCU_PGM_OUT: R33.2 U1.7(PA1)
MCU_RF_D0: R20.1 U1.25(PA15)
MCU_RF_D1: R21.1 U1.26(PB3)
MCU_RF_D2: R22.1 U1.27(PB4)
MCU_RF_D3: R23.1 U1.28(PB5)
MCU_RX: R17.2 U1.9(PA3)
MCU_SIREN_OUT: R35.2 U1.6(PA0)
MCU_SWITCH: D10.2(A) U1.14(PB0)
MCU_TX: R16.2 U1.8(PA2)
MCU_ZONE_1: C24.2 R2.2 U1.10(PA4)
MCU_ZONE_2: C25.2 R4.2 U1.11(PA5)
MCU_ZONE_3: C26.2 R6.2 U1.12(PA6)
MCU_ZONE_4: C27.2 R8.2 U1.13(PA7)
MCU_ZONE_LED: R13.2 U1.22(PA12)
NRST: U1.4(NRST) U2.5
RF_D0: P9.3 R20.2
RF_D1: P9.4 R21.2
RF_D2: P9.5 R22.2
RF_D3: P9.6 R23.2
SWCLK: U1.24(PA14(SWCLK)) U2.2
SWDIO: U1.23(PA13(SWDIO)) U2.4
SWITCH: P5.1 R11.1
WDOG_LED: R15.1 U1.30(PB7)
ZONE_1: P1.1 R1.1
ZONE_2: P1.3 R3.1
ZONE_3: P2.1 R5.1
ZONE_4: P2.3 R7.1
ZONE_STATUS: P4.1 R13.1
$1N2276: LED1.2(K) R14.2
$1N2278: LED2.1(K) R15.2
$1N5420: LED3.1(K) R19.2
$1N9908: F3.1 U6.1(K)
$2N1215: D9.3 R9.2 R10.1
$2N1227: D10.1(K) R11.2
$2N1236: D1.1(K) R1.2
$2N1237: D1.2(A) D2.3 R2.1
$2N1245: D3.2(A) D4.3 R4.1
$2N1246: D3.1(K) R3.2
$2N1251: D7.1(K) R7.2
$2N1257: D5.2(A) D6.3 R6.1
$2N1258: D5.1(K) R5.2
$2N1261: D7.2(A) D8.3 R8.1
$2N2416: BUZZER1.2 D13.2(A) R28.2
$2N2418: Q1.3(C) R28.1
$2N2519: Q1.1(B) R29.2 R30.1
$2N2755: Q2.1(B) R32.2 R33.1
$2N3005: D14.2(A) P6.2 Q2.2(C)
$2N3012: D14.1(K) F1.1 P6.1
$2N3324: D15.1(K) F2.1 P7.1
$2N3330: D15.2(A) P7.2 Q3.2(C)
$2N3341: Q3.1(B) R34.2 R35.1

Not connected (* = marked no-connect by the designer): LDO1 4(NC)

## Notes on the sheets
sheet 1
- MCU POWER
sheet 2
- MCU Outputs
- MCU Inputs
- MCU Communication
- ON/OFF TRIGGER INPUTS
- SYSTEM INDICATION LEDS
- I2C BUS
- COMMUNICATION
- ZONE INPUTS 1-2
- BLUE TOOTH
- MODULE
- RF RECEIVER
- MODULE
- 433MHZ
- ZONE INPUTS 3-4
- FIRMWARE
- JTAG +
- UPLOAD

# Board Main_PCB
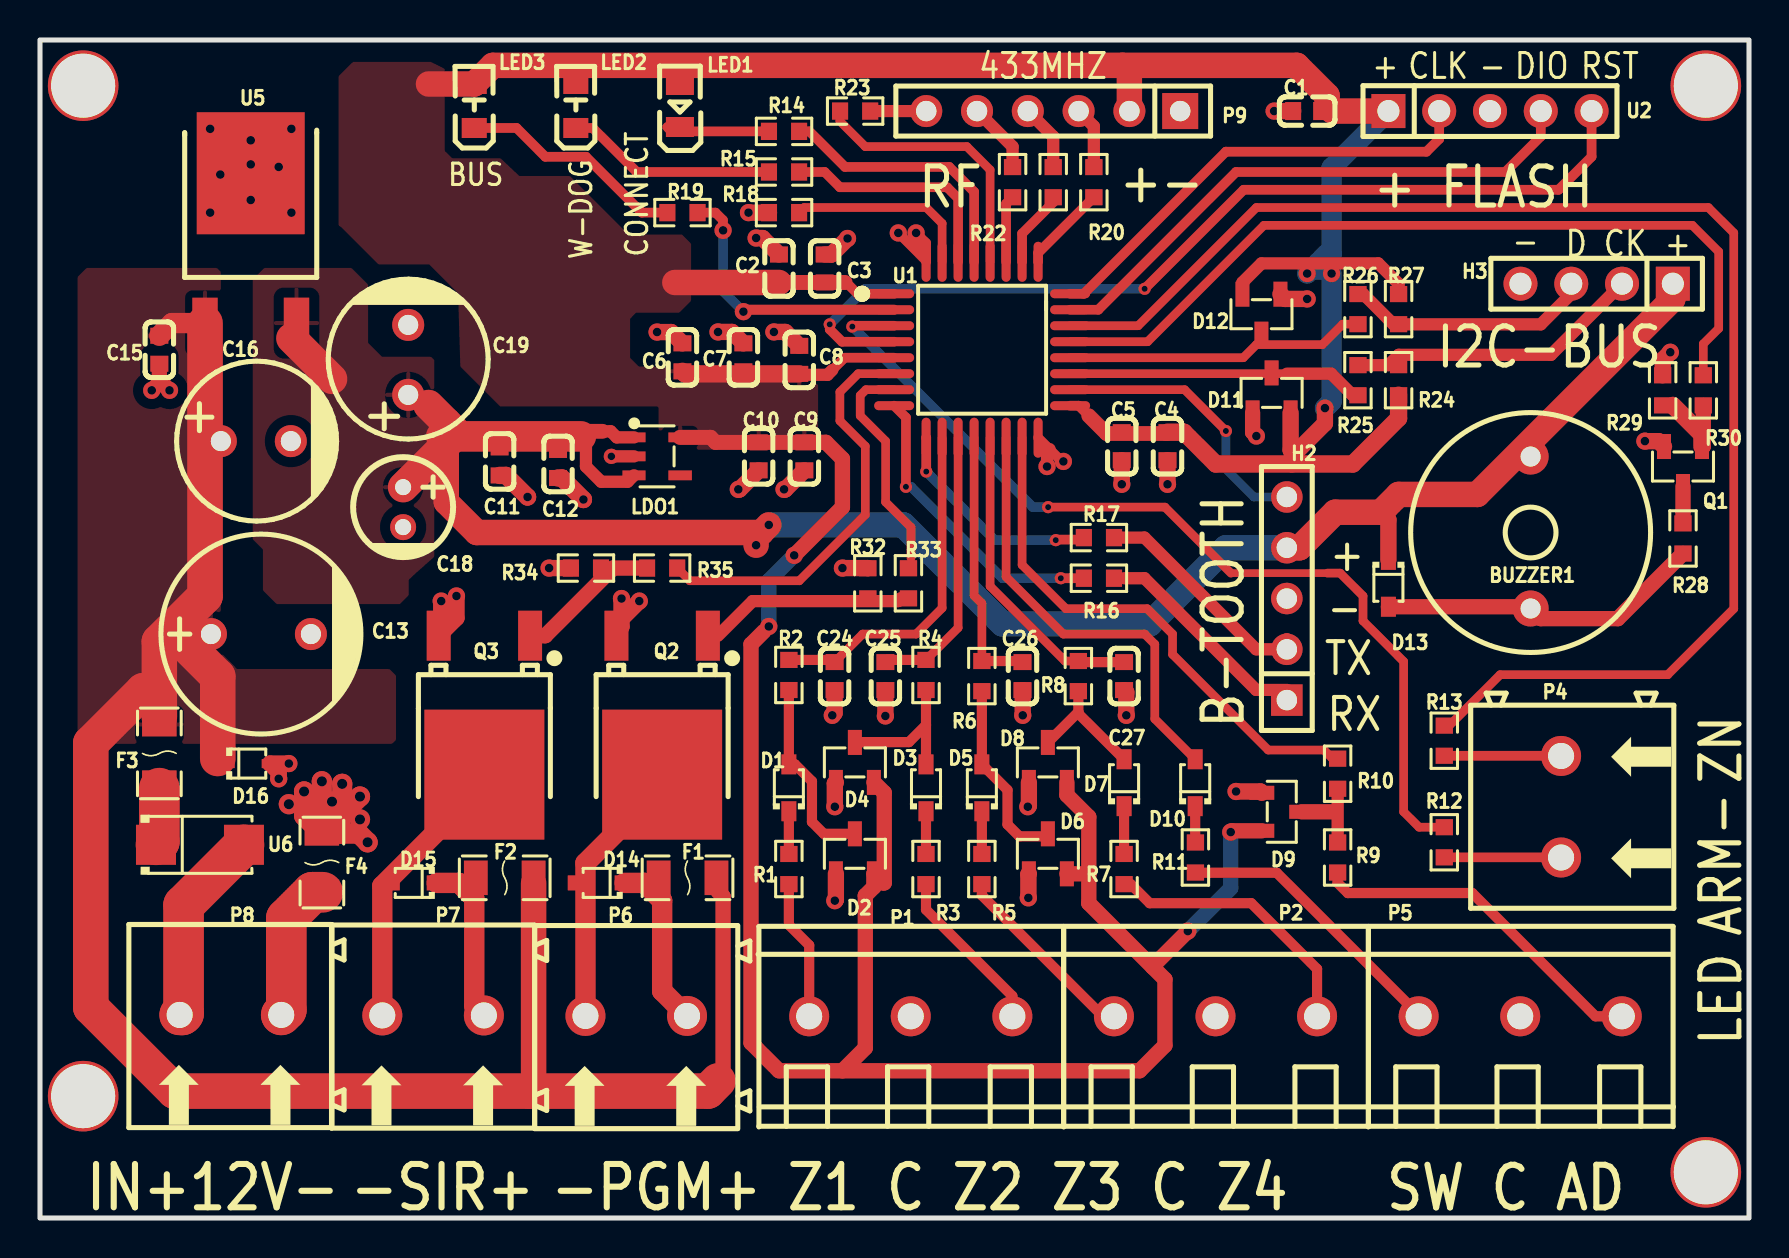
[diagram p2: board, top side]
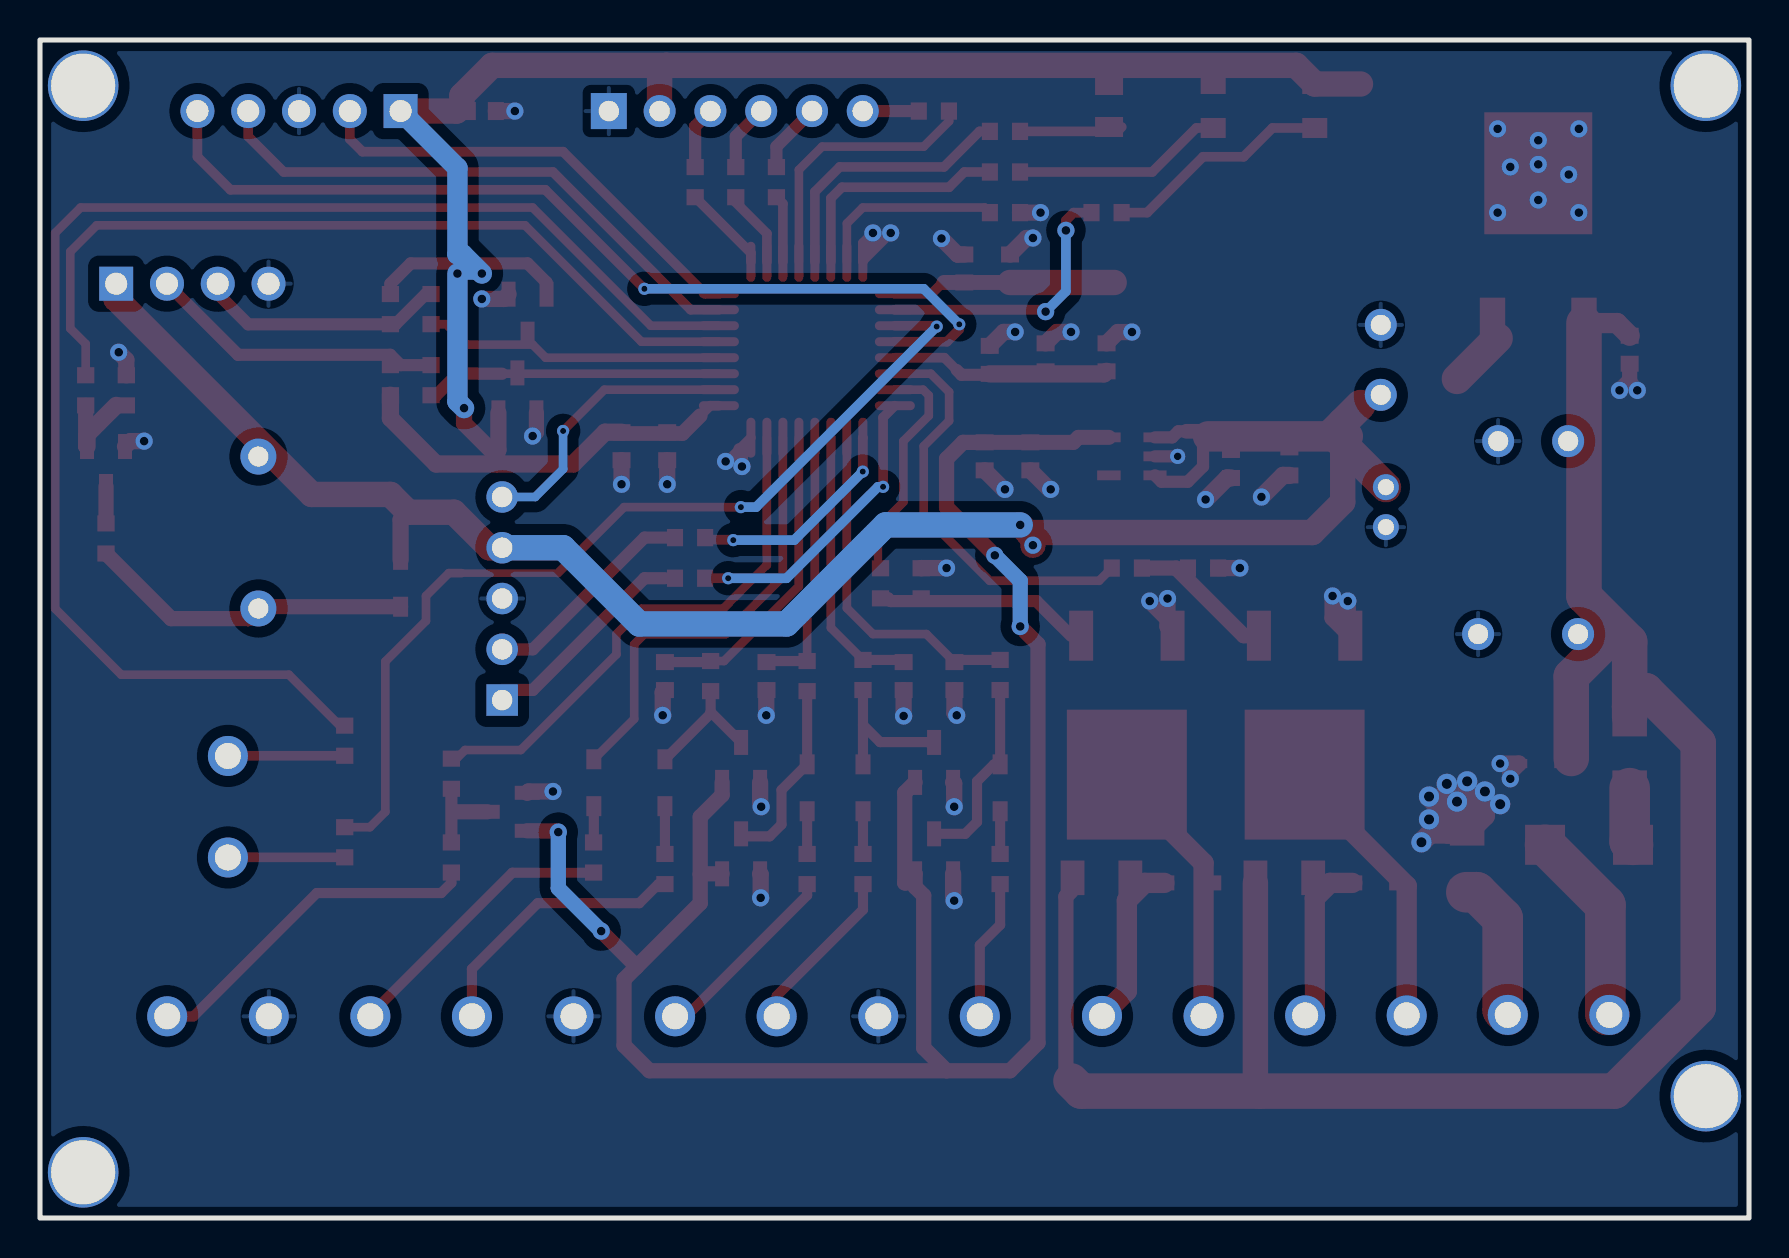
[diagram p3: board, bottom side, seen from below]

Outline 85.47 x 58.93 mm; copper layers: Top Layer, Bottom Layer. Coordinates in mm from the lower left corner of the outline.
Outline path: rectangle 0,58.93 85.47,0
Stack: Top Layer 0.035mm / Dielectric1 1.51mm FR4 er 4.5 / Bottom Layer 0.035mm

## Design rules (mm)
template: Custom Config
spacing copperThickness1oz (default): track to track 0.102, other pairs 0.152 to 0.3
spacing copperThickness2oz: track to track 0.203, other pairs 0.152 to 0.3
track width copperThickness1oz (default): min 0.127, default 0.254, max 2.54
track width copperThickness2oz: min 0.203, default 0.254, max 2.54
differential pair differentialPair (default): width min 0.127, default 0.254, max 2.54; gap min 0.152, default 0.152
via viaSize (default): diameter min 0.5, default 0.61, max 10; hole min 0.3, default 0.305, max 6.3
net GND uses tasoscopperRegion
pour e570 uses tasoscopperRegion

## Placement (name value [footprint] x y rotation side)
BUZZER1  2.4kHz  [BUZ-TH_BD12.0-P7.60-D0.6-FD]  74.55 34.29 270 top
C1  100nF  [C0603]  63.37 55.37 0 top
C2  10uF  [C0603]  36.96 47.5 270 top
C3  100nF  [C0603]  39.24 47.5 270 top
C4  10uF  [C0603]  56.39 38.61 90 top
C5  100nF  [C0603]  54.1 38.61 90 top
C6  10uF  [C0603]  32.13 43.05 270 top
C7  10nF  [C0603]  35.18 43.05 270 top
C8  10nF  [C0603]  37.97 42.93 270 top
C9  10uF  [C0603]  38.23 38.1 90 top
C10  100nF  [C0603]  35.94 38.1 90 top
C11  10uF  [C0603]  22.99 37.85 90 top
C12  100nF  [C0603]  25.91 37.72 90 top
C13  1000uF  [CAP-TH_BD10.0-P5.00-D0.6-FD]  11.05 29.21 0 top
C15  100nF  [C0603]  5.97 43.43 90 top
C16  470uF  [CAP-TH_BD8.0-P3.50-D0.6-FD_1]  10.8 38.86 0 top
C18  100uF  [CAP-TH_BD5.0-P2.00-D0.8-FD]  18.16 35.56 270 top
C19  1000uF  [CAP-TH_BD8.0-P3.50-D0.6-FD]  18.42 42.93 90 top
C24  10nF  [C0603]  39.74 27.11 90 top
C25  10nF  [C0603]  42.28 27.11 90 top
C26  10nF  [C0603]  49.14 27.11 90 top
C27  10nF  [C0603]  54.22 27.11 90 top
D1  1N5819WS  [SOD-323_L1.8-W1.3-LS2.5-RD]  37.45 21.52 90 top
D2  BAT54S  [SOT-23-3_L2.9-W1.3-P1.90-LS2.4-BR]  40.76 18.22 270 top
D3  1N5819WS  [SOD-323_L1.8-W1.3-LS2.5-RD]  44.31 21.52 90 top
D4  BAT54S  [SOT-23-3_L2.9-W1.3-P1.90-LS2.4-BR]  40.76 22.79 270 top
D5  1N5819WS  [SOD-323_L1.8-W1.3-LS2.5-RD]  47.11 21.52 90 top
D6  BAT54S  [SOT-23-3_L2.9-W1.3-P1.90-LS2.4-BR]  50.41 18.22 270 top
D7  1N5819WS  [SOD-323_L1.8-W1.3-LS2.5-RD]  54.22 21.77 90 top
D8  BAT54S  [SOT-23-3_L2.9-W1.3-P1.90-LS2.4-BR]  50.41 22.79 270 top
D9  BAT54S  [SOT-23-3_L2.9-W1.3-P1.90-LS2.4-BR]  62.1 20.32 180 top
D10  1N5819WS  [SOD-323_L1.8-W1.3-LS2.5-RD]  57.77 21.77 90 top
D11  BAT54S  [SOT-23-3_L2.9-W1.3-P1.90-LS2.4-BR]  61.59 41.28 270 top
D12  BAT54S  [SOT-23-3_L2.9-W1.3-P1.90-LS2.4-BR]  61.09 45.21 90 top
D13  1N5819WS  [SOD-323_L1.8-W1.3-LS2.5-RD]  67.44 31.75 270 top
D14  1N5819WS  [SOD-323_L1.8-W1.3-LS2.5-RD]  28.07 16.76 180 top
D15  1N5819WS  [SOD-323_L1.8-W1.3-LS2.5-RD]  18.67 16.76 180 top
D16  SD12  [SOD-323_L1.7-W1.3-LS2.7-RD]  10.41 22.73 0 top
F1  JK-nSMD010/60V  [F1206]  32.39 17.02 0 top
F2  JK-nSMD010/60V  [F1206]  23.24 17.02 0 top
F3  SMD1206-150C-16V  [F1206]  5.97 23.24 90 top
F4  SMD1206-150C-16V  [F1206]  14.1 17.78 90 top
H2  2.54-1*5P母  [HDR-TH_5P-P2.54-V-F]  62.36 30.99 90 top
H3  2.54-1*4P母  [HDR-TH_4P-P2.54-V-F]  77.85 46.74 180 top
LDO1  ME6211C33M5G-N  [SOT-23-5_L3.0-W1.7-P0.95-LS2.8-BL]  30.86 38.1 270 top
LED1  XL-2012SURC  [LED0805-R-RD]  32 55.63 90 top
LED2  XL-2012UGC  [LED0805-RD_GREEN]  26.8 55.63 90 top
LED3  XL-2012UGC  [LED0805-RD_GREEN]  21.72 55.63 90 top
NOREF  -  [Pad_e479]  2.16 56.64 0 top
NOREF#2  -  [Pad_e487]  83.31 56.64 0 top
NOREF#3  -  [Pad_e485]  2.16 6.1 0 top
NOREF#4  -  [Pad_e486]  83.31 2.29 0 top
P1  WJ500V-5.08-3P  [CONN-TH_3P-P5.00_WJ500V-5.08-3P]  43.55 10.09 0 top
P2  WJ500V-5.08-3P  [CONN-TH_3P-P5.00_WJ500V-5.08-3P]  58.79 10.09 0 top
P4  WJ500V-5.08-2P  [CONN-TH_2P-P5.00_WJ500V-5.08-2P]  76.07 20.57 270 top
P5  WJ500V-5.08-3P  [CONN-TH_3P-P5.00_WJ500V-5.08-3P]  74.03 10.09 0 top
P6  WJ500V-5.08-2P  [CONN-TH_2P-P5.00_WJ500V-5.08-2P]  29.82 10.11 180 top
P7  WJ500V-5.08-2P  [CONN-TH_2P-P5.00_WJ500V-5.08-2P]  19.66 10.13 180 top
P8  WJ500V-5.08-2P  [CONN-TH_2P-P5.00_WJ500V-5.08-2P]  9.53 10.16 180 top
P9  2.54-1*6P母  [HDR-TH_6P-P2.54-V-F]  50.67 55.37 180 top
Q1  MMBT3904(RANGE:100-300)  [SOT-23-3_L2.9-W1.3-P1.90-LS2.4-BR]  82.17 37.59 90 top
Q2  MJD122  [TO-252-3_L6.6-W6.1-P4.57-LS9.9-BR-CW]  31.11 25.65 90 top
Q3  MJD122  [TO-252-3_L6.6-W6.1-P4.57-LS9.9-BR-CW]  22.23 25.65 90 top
R1  100Ω  [R0603]  37.45 17.46 90 top
R2  100Ω  [R0603]  37.45 27.16 90 top
R3  100Ω  [R0603]  44.31 17.46 90 top
R4  100Ω  [R0603]  44.31 27.16 90 top
R5  100Ω  [R0603]  47.11 17.46 90 top
R6  100Ω  [R0603]  47.11 27.11 90 top
R7  100Ω  [R0603]  54.22 17.46 90 top
R8  100Ω  [R0603]  51.93 27.11 90 top
R9  10Ω  [R0603]  64.9 18.03 90 top
R10  1kΩ  [R0603]  64.9 22.23 90 top
R11  100Ω  [R0603]  57.79 18.03 90 top
R12  1kΩ  [R0603]  70.23 18.8 90 top
R13  1kΩ  [R0603]  70.23 23.88 90 top
R14  1kΩ  [R0603]  37.21 54.36 180 top
R15  1kΩ  [R0603]  37.21 52.32 180 top
R16  100Ω  [R0603]  52.96 32 180 top
R17  100Ω  [R0603]  52.96 34.04 180 top
R18  560Ω  [R0603]  37.21 50.29 180 top
R19  1kΩ  [R0603]  32.13 50.29 180 top
R20  100Ω  [R0603]  52.7 51.82 90 top
R21  100Ω  [R0603]  50.67 51.82 90 top
R22  100Ω  [R0603]  48.64 51.82 90 top
R23  100Ω  [R0603]  40.77 55.37 0 top
R24  4.7kΩ  [R0603]  67.95 41.91 270 top
R25  10Ω  [R0603]  65.91 41.91 90 top
R26  10Ω  [R0603]  65.91 45.47 90 top
R27  4.7kΩ  [R0603]  67.95 45.47 270 top
R28  10Ω  [R0603]  82.17 33.99 270 top
R29  10kΩ  [R0603]  81.15 41.4 270 top
R30  2kΩ  [R0603]  83.18 41.4 90 top
R32  10kΩ  [R0603]  41.4 31.75 270 top
R33  2kΩ  [R0603]  43.43 31.75 90 top
R34  10kΩ  [R0603]  27.3 32.51 0 top
R35  2kΩ  [R0603]  31.11 32.51 0 top
U1  STM32F030K6T6  [TQFP-32_L7.0-W7.0-P0.50-BL]  47.12 43.43 270 top
U2  HB-PH3-25415PB2GOP  [HDR-TH_5P-P2.54-V-M]  72.52 55.37 0 top
U5  L7805CDT-TR  [TO-252-3_L6.5-W5.8-P4.58-BL]  10.54 48.51 0 top
U6  SS26  [SMA_L4.3-W2.6-LS5.1-RD]  8 18.67 0 top

## Footprints (pads in the part's own frame, mm; a bottom-side part is the same pattern mirrored in y, then rotated)
BUZ-TH_BD12.0-P7.60-D0.6-FD
  round 1.8 hole 1: 1(-3.8,0) 2(3.8,0)
C0603
  rect 0.8x0.9 smd: 1(-0.7,0) 2(0.7,0)
CAP-TH_BD5.0-P2.00-D0.8-FD
  round 1.3 hole 0.8: 1(-1,0) 2(1,0)
CAP-TH_BD8.0-P3.50-D0.6-FD
  round 1.6 hole 1: 1(-1.75,0) 2(1.75,0)
CAP-TH_BD8.0-P3.50-D0.6-FD_1
  round 1.6 hole 1: 1(-1.75,0) 2(1.75,0)
CAP-TH_BD10.0-P5.00-D0.6-FD
  round 1.6 hole 1: 1(-2.5,0) 2(2.5,0)
CONN-TH_2P-P5.00_WJ500V-5.08-2P
  round 2 hole 1.3: 1(-2.54,0) 2(2.54,0)
CONN-TH_3P-P5.00_WJ500V-5.08-3P
  round 2 hole 1.3: 1(-5.08,0) 2(0,0) 3(5.08,0)
F1206
  rect 1.19x1.728 smd: 1(-1.445,0) 2(1.445,0)
HDR-TH_4P-P2.54-V-F
  rect 1.7x1.7 hole 1.1: 1(-3.81,0)
  round 1.7 hole 1.1: 2(-1.27,0) 3(1.27,0) 4(3.81,0)
HDR-TH_5P-P2.54-V-F
  rect 1.575x1.575 hole 1.02: 1(-5.08,0)
  round 1.575 hole 1.02: 2(-2.54,0) 3(0,0) 4(2.54,0) 5(5.08,0)
HDR-TH_5P-P2.54-V-M
  rect 1.7x1.7 hole 1.1: 1(-5.08,0)
  round 1.7 hole 1.1: 2(-2.54,0) 3(0,0) 4(2.54,0) 5(5.08,0)
HDR-TH_6P-P2.54-V-F
  rect 1.8x1.8 hole 1.02: 1(-6.35,0)
  round 1.6 hole 1.02: 2(-3.81,0) 3(-1.27,0) 4(1.27,0) 5(3.81,0) 6(6.35,0)
LED0805-R-RD
  rect 1x1.399 smd: 1(1.05,0) 2(-1.05,0)
LED0805-RD_GREEN
  rect 1x1.25 smd: 1(-1.1,0) 2(1.1,0)
Pad_e479
  round 3.53 hole 3.2: 1(0,0)
Pad_e485
  round 3.53 hole 3.2: 1(0,0)
Pad_e486
  round 3.53 hole 3.2: 1(0,0)
Pad_e487
  round 3.53 hole 3.2: 1(0,0)
R0603
  rect 0.806x0.864 smd: 1(-0.753,0) 2(0.753,0)
SMA_L4.3-W2.6-LS5.1-RD
  rect 2x2 smd: 1(-2.2,0) 2(2.2,0)
SOD-323_L1.7-W1.3-LS2.7-RD
  rect 0.845x0.455 smd: 1(-1.097,0) 2(1.097,0)
SOD-323_L1.8-W1.3-LS2.5-RD
  rect 1x0.75 smd: 1(-1.173,0) 2(1.173,0)
SOT-23-3_L2.9-W1.3-P1.90-LS2.4-BR
  rect 1.25x0.7 smd: 1(1,-0.95) 2(1,0.95) 3(-1,0)
SOT-23-5_L3.0-W1.7-P0.95-LS2.8-BL
  rect 0.49x1.157 smd: 1(-0.95,-1.153) 2(0,-1.153) 3(0.95,-1.153)
  rect 0.49x1.175 smd: 4(0.95,1.153) 5(-0.95,1.153)
TO-252-3_L6.5-W5.8-P4.58-BL
  rect 1.27x2.54 smd: 1(-2.288,-3.747) 3(2.288,-3.745)
  rect 5.4x6.1 smd: 2(-0.002,3.747)
TO-252-3_L6.6-W6.1-P4.57-LS9.9-BR-CW
  rect 2.5x1.2 smd: 1(3.475,-2.286) 3(3.475,2.286)
  rect 6.5x6 smd: 2(-3.475,0)
TQFP-32_L7.0-W7.0-P0.50-BL
  oval 0.45x2 smd: 1(-2.8,-4.4) 2(-2,-4.4) 3(-1.2,-4.4) 4(-0.4,-4.4) 5(0.4,-4.4) 6(1.2,-4.4) 7(2,-4.4) 8(2.8,-4.4) 17(2.8,4.4) 18(2,4.4) 19(1.2,4.4) 20(0.4,4.4) 21(-0.4,4.4) 22(-1.2,4.4) 23(-2,4.4) 24(-2.8,4.4)
  oval 2x0.45 smd: 9(4.4,-2.8) 10(4.4,-2) 11(4.4,-1.2) 12(4.4,-0.4) 13(4.4,0.4) 14(4.4,1.2) 15(4.4,2) 16(4.4,2.8) 25(-4.4,2.8) 26(-4.4,2) 27(-4.4,1.2) 28(-4.4,0.4) 29(-4.4,-0.4) 30(-4.4,-1.2) 31(-4.4,-2) 32(-4.4,-2.8)

## Nets
As in the schematic.

Pads without a net: LDO1 4; NOREF 1; NOREF#2 1; NOREF#3 1; NOREF#4 1

## Via types
v1: diameter 0.864, hole 0.432, Top Layer to Bottom Layer, 60 vias
v2: diameter 1.016, hole 0.508, Top Layer to Bottom Layer, 8 vias
v3: diameter 0.762, hole 0.381, Top Layer to Bottom Layer, 1 via
v4: diameter 0.61, hole 0.305, Top Layer to Bottom Layer, 9 vias

## Routing (per net, layer and track width the routed paths; a pad name or vN(x,y) marks a point on that pad's centre or on a via; arc(x,y) is an arc through that point)
+5V: length 101.6
  Top Layer w0.61: 27.3,39.3 27.3,37.59 28.07,36.83 29.39,36.83 LDO1.3 ; 28.13,39.35 28.54,39.35 28.84,39.05 LDO1.1
  Top Layer w0.737: 28.13,39.35 27.36,39.35
  Top Layer w0.813: 67.06,35.31 67.44,34.92 D13.1
  Top Layer w1.27: H2.4 62.99,33.53 64.77,35.31 67.06,35.31 67.95,36.2 71.88,36.2 81.66,45.97 H3.1 ; 36.07,34.29 21.84,34.29 20.32,35.81 20.32,39.78 ; 36.07,34.29 35.81,34.04 v1(35.81,33.66) ; 36.07,34.29 v1(36.45,34.67)
  Top Layer w1.524: 12.58,44.01 14.61,41.98 ; 20.7,39.1 C18.1 ; 20.7,39.1 20.07,39.1 ; 20.7,39.1 20.85,39.25 19.43,40.67 ; 20.7,39.1 27.05,39.1
  Bottom Layer w1.27: v1(36.45,34.67) 43.18,34.67 48.13,29.72 55.5,29.72 59.31,33.53 H2.4
+12V: length 102.1
  Top Layer w0.762: 34.29,6.83 34.16,6.96 34.16,16.08 33.91,16.34
  Top Layer w1.016: U5.1 6.6,44.77 C15.2
  Top Layer w1.27: 24.46,6.35 24.46,6.6 24.69,6.83 24.69,16.76
  Top Layer w1.778: 33.91,6.86 33.4,6.35 6.73,6.35 2.54,10.54 2.54,23.75 5.17,26.38 5.97,25.58 ; 6.73,29.46 6.73,29.25 8.89,27.09 8.89,22.99 ; 5.97,25.58 5.97,28.83 8.25,31.11 U5.1 ; 5.97,25.58 5.97,25.07
GND: length 81.1
  Top Layer w0.482: U1.32 44.32,47.89 ; 44.32,47.89 44.32,48.14 ; 44.32,47.89 v1(42.93,49.28) ; 44.32,48.14 44.32,48.77 v1(43.82,49.28) ; 44.32,48.14 43.69,48.77 ; v1(51.18,37.85) 51.11,37.85 U1.16
  Top Layer w0.61: v1(8.51,50.29) 8.51,52.51 9.4,53.4 ; LDO1.2 v3(28.58,38.1) ; v1(10.54,52.7) 10.54,52.26 U5.2 9.4,53.4 ; 9.4,53.4 8.51,54.29 v1(8.51,54.48) ; v1(50.36,37.59) 50.36,38.33 50.49,38.46 ; v1(12.57,54.48) v1(12.57,50.29)
  Top Layer w0.762: v1(60.83,39.12) 60.64,39.3 D11.1 ; 5.97,41.91 C15.1 ; 5.97,41.91 v1(6.48,41.4) ; 5.97,41.91 5.97,41.78 v1(5.59,41.4)
  Top Layer w0.813: D6.1 49.43,17.19 v1(49.43,16.02) ; C24.1 39.74,25.26 v1(39.62,25.15) ; C3.1 39.58,48.2 v1(40.39,49) ; Q1.2 80.95,38.86 v1(80.26,38.86) ; C26.1 49.15,26.4 v1(49.15,25.15) ; v1(37.21,36.45) 37.28,36.45 C9.1 ; 20.07,29.26 20.83,30.02 v1(20.83,31.11) ; 20.07,29.26 v1(20.07,30.86) ; 20.07,29.26 Q3.3 ; D9.1 61.04,21.34 v1(59.82,21.34) ; v1(29.97,30.86) 29.08,29.97 ; 29.08,29.97 29.08,29.59 28.83,29.34 Q2.3 ; 29.08,29.97 v1(29.08,30.99) ; D4.1 39.75,21.74 v1(39.75,20.57) ; v1(34.92,36.45) 34.99,36.45 C10.1 ; C8.1 37.28,44.32 v1(36.7,44.32) ; R29.1 81.15,42.93 v1(81.53,43.31) ; v1(30.86,44.32) 31.57,44.32 C6.1 ; C2.1 36.13,49.02 v1(35.81,49.02) ; v1(40.13,32.51) 41.39,32.51 R32.1 ; v1(49.4,20.57) 49.46,20.63 D8.1 ; v1(12.45,22.73) D16.2 11.94,22.31 v1(11.94,21.97) ; v1(33.91,44.32) 34.61,44.32 C7.1 ; v1(25.46,32.51) R34.1 ; R18.2 v1(35.43,50.29) ; C1.1 v1(61.72,55.37) ; D12.1 62.27,45.97 v1(63.37,45.97) ; C5.1 v1(54.1,36.7) ; v1(39.75,15.88) 39.8,15.93 D2.1 ; C27.1 54.33,26.3 v1(54.33,25.15) ; C4.1 v1(56.39,36.7) ; C25.1 v1(42.28,25.11)
  Top Layer w0.864: v1(24.38,36.07) 23.31,37.15 C11.1 ; v1(27.18,35.94) 26.1,37.02 C12.1
  Top Layer w1.001: F4.2 13.21,20.11 v2(13.21,21.34) ; F4.2 v2(14.1,21.84) ; F4.2 15.03,19.23 ; v2(16.38,18.8) 15.95,19.23 15.03,19.23 ; 15.03,19.23 15.03,20.11 v2(16,21.08) ; v2(14.61,20.83) 14.61,19.73 15.11,20.24 v2(15.11,21.72)
  vias: v1(9.02,52.2) v1(10.54,53.91) v1(10.54,50.92) v1(11.94,52.58) v2(12.45,20.7) v2(16,19.94)
VCC: length 230.9
  Top Layer w0.482: U1.17 51.95,40.63 52.45,40.13 ; 39.62,42.42 40.24,43.03 U1.5 ; U1.1 40.89,46.23 40.51,46.61 ; 38.04,42.16 C8.2
  Top Layer w0.61: R27.1 67.95,46.74 66.93,47.75 61.09,47.75 60.14,46.8 D12.2 ; 38.02,42.18 39.39,42.18 39.62,42.42
  Top Layer w0.737: 52.45,40.13 53.34,39.24 56.32,39.24 C4.2
  Top Layer w0.75: LDO1.5 33.54,39.05 33.79,38.8 C10.2 C9.2 ; 40.26,46.8 C3.2 C2.2
  Top Layer w0.762: v1(57.4,14.35) 55.65,12.6 55.65,12.55 ; D9.2 59.62,19.37 v1(59.55,19.3) ; D4.2 42.22,21.27 42.22,16.76 42.16,16.76 D2.2 41.7,16.56 41.27,16.13 41.27,8.51 40.13,7.37 ; 52.45,17.2 52.45,15.75 55.65,12.55 ; 52.45,17.2 52.43,17.22 D6.2 ; 52.45,17.2 52.45,20.07 51.36,21.16 D8.2 ; 55.65,12.55 56.26,11.94 56.26,8.64 54.99,7.37 40.13,7.37 ; 36.2,29.34 35.56,28.7 35.56,8.76 36.96,7.37 40.13,7.37 ; v1(37.72,33.15) 40.13,35.56 40.13,37.97 39.3,38.8 C9.2
  Top Layer w0.813: v1(64.26,40.51) 64.26,39.75 62.86,38.35 62.61,38.35 ; 62.61,38.35 62.55,38.42 D11.2 ; 62.61,38.35 62.61,37.72
  Top Layer w0.864: C8.2 32.26,42.23 C6.2 ; R24.2 67.95,40 65.66,37.72 58.8,37.72 57.21,39.31 C4.2
  Top Layer w1.27: 54.14,57.66 54.48,57.32 P9.2 ; 54.14,57.66 22.65,57.66 LED3.2 19.43,56.73 ; 54.14,57.66 62.86,57.66 64.37,56.15 64.37,55.65 64.64,55.37 U2.1 ; C2.2 31.75,46.8
  Bottom Layer w0.61: v1(64.59,47.24) v1(63.37,47.24)
  Bottom Layer w0.762: v1(57.4,14.35) 59.55,16.5 v1(59.55,19.3) ; v1(37.72,33.15) 36.45,31.88 v1(36.45,29.59)
  Bottom Layer w1.016: v1(63.37,47.24) 64.33,48.2 64.59,48.2 64.59,52.53 U2.1 ; v1(64.59,47.24) 64.59,40.85 v1(64.26,40.51)
+IN_12V: length 9.9
  Top Layer w2.032: P8.2 7.11,10.16 7.18,10.23 7.18,15.65 U6.2
-IN_12V: length 7.3
  Top Layer w2.032: P8.1 12.32,10.41 12.32,14.99 13.63,16.3 14.14,16.3
ADC_SWITCH: length 17.5
  Top Layer w0.508: R9.1 64.9,16.76 65.4,16.26 71.63,16.26 77.79,10.09 P5.3
ARM_STATUS: length 5.8
  Top Layer w0.482: R12.1 76.06,18.04 P4.2
B-TOOTH_EN: length 14.2
  Top Layer w0.432: v4(59.31,39.37) 57.24,41.43 U1.18
  Bottom Layer w0.432: v4(59.31,39.37) 59.31,37.47 60.71,36.07 H2.5
B-TOOTH_RX: length 10.5
  Top Layer w0.61: 54.22,32 55.24,32 60.82,26.42 62.36,26.42
B-TOOTH_TX: length 11.2
  Top Layer w0.61: R17.1 55.24,34.04 60.82,28.45 61.85,28.45 62.36,28.96
BLUE_LED: length 14
  Top Layer w0.482: v1(34.16,49.4) 34.15,49.41 34.15,49.92 33.78,50.29 R19.1
  Top Layer w0.5: v1(35.18,45.34) 35.27,45.43 U1.2
  Bottom Layer w0.482: v1(34.16,49.4) 34.16,46.36 v1(35.18,45.34)
CONNECT_LED: length 13.5
  Top Layer w0.482: R14.1 38.48,54.36 40.26,52.58 45.47,52.58 46.72,51.33 U1.29
I2C_SCL: length 14.9
  Top Layer w0.61: R25.2 67.44,42.66 67.95,43.18 75.57,43.18 H3.2
I2C_SDA: length 12.4
  Top Layer w0.61: R26.2 66.18,46.22 67.69,44.7 75.06,44.7 76.58,46.23 H3.3
MCU_ADC_SWITCH: length 26.8
  Top Layer w0.432: U1.15 49.12,32.67 51.31,30.48 55.37,30.48 56.64,29.21 56.64,28.19 61.43,23.41 64.21,23.41 64.64,22.98 R10.2
MCU_ARM_LED: length 47.2
  Top Layer w0.381: 64.39,32.26 59.56,32.26
  Top Layer w0.432: 59.56,32.26 56.26,35.56 v4(50.42,35.56) ; 64.39,32.26 65.02,32.26 66.17,31.11 66.17,29.87 68.2,27.84 68.2,20.32 68.97,19.55 R12.2
  Top Layer w0.482: U1.3 40.67,44.63 v4(40.63,44.59)
  Bottom Layer w0.482: v4(40.63,44.59) 49.66,35.56 v4(50.42,35.56)
MCU_BOOT: length 9.5
  Top Layer w0.432: R18.1 38.22,50.55 44.32,50.55 45.12,49.75 U1.31
MCU_BUZZER_OUT: length 41.9
  Top Layer w0.432: U1.21 55.39,43.83 61.21,49.66 82.64,49.66 83.96,48.34 83.96,44.5 83.18,43.73 R30.2
MCU_I2C_SCL: length 14.8
  Top Layer w0.432: U1.19 62.36,42.23
  Top Layer w0.61: R25.1 65.65,41.16 64.57,42.23 62.36,42.23
MCU_I2C_SDA: length 15.1
  Top Layer w0.432: R26.1 65.15,44.71 64.13,43.69 60.83,43.69 60.18,43.03 U1.20
MCU_PGM_OUT: length 11
  Top Layer w0.432: U1.7 41.31,41.43 41.02,41.15 41.02,40.13 42.29,38.86 42.29,35.81 43.56,34.54 43.56,33.01
MCU_RF_D0: length 4.4
  Top Layer w0.482: U1.25 49.92,48.27 R20.1
MCU_RF_D1: length 4
  Top Layer w0.482: R21.1 50.8,50.93 49.12,49.24 U1.26
MCU_RF_D2: length 3.4
  Top Layer w0.482: R22.1 48.32,50.74 U1.27
MCU_RF_D3: length 13.4
  Top Layer w0.432: 40.01,55.11 40.01,54.86 41.27,53.59 46.36,53.59 47.52,52.43 U1.28
MCU_RX: length 11.1
  Top Layer w0.482: v4(50.8,33.91) 50.83,33.93 52.1,33.93 R17.2 ; U1.9 44.32,39.03 v4(44.32,37.34)
  Bottom Layer w0.482: v4(50.8,33.91) 47.75,33.91 v4(44.32,37.34)
MCU_SIREN_OUT: length 20.8
  Top Layer w0.432: R35.2 32.5,31.88 37.97,31.88 41.27,35.18 41.27,38.61 40.01,39.88 40.01,41.32 40.92,42.23 U1.6
MCU_SWITCH: length 22.4
  Top Layer w0.432: D10.2 55.75,24.97 55.75,28.7 55.24,29.21 51.18,29.21 48.32,32.07 U1.14
MCU_TX: length 15.1
  Top Layer w0.482: U1.8 43.31,40.04 v4(43.31,36.58) ; v4(51.05,32) R16.2
  Bottom Layer w0.482: v4(51.05,32) 48.13,32 43.56,36.58 v4(43.31,36.58)
MCU_ZONE_1: length 17.4
  Top Layer w0.432: C24.2 41.14,29.21 43.82,29.21 45.12,30.51 U1.10
  Top Layer w0.508: R2.2 39.63,27.92 C24.2
MCU_ZONE_2: length 13.9
  Top Layer w0.432: U1.11 45.92,29.52 R4.2
  Top Layer w0.508: R4.2 42.39,27.92 C25.2
MCU_ZONE_3: length 13.4
  Top Layer w0.432: R6.2 47.11,30.75 46.72,31.13 U1.12
  Top Layer w0.508: C26.2 49.08,27.86 R6.2
MCU_ZONE_4: length 15.7
  Top Layer w0.432: R8.2 51.26,27.86 47.52,31.6 U1.13
  Top Layer w0.508: R8.2 51.98,27.81 C27.2
MCU_ZONE_LED: length 71.9
  Top Layer w0.432: R13.2 70.48,24.63 73.02,27.18 81.41,27.18 84.71,30.48 84.71,49.28 83.44,50.55 60.83,50.55 54.92,44.63 U1.22
NRST: length 47.6
  Top Layer w0.482: U2.5 77.6,53.09 75.95,51.44 60.2,51.44 v4(55.24,46.48) ; U1.4 40.11,43.83 39.5,44.45 v4(39.5,44.7)
  Bottom Layer w0.482: v4(55.24,46.48) 41.27,46.48 v4(39.5,44.7)
RF_D0: length 3.1
  Top Layer w0.61: P9.3 52.7,54.61 R20.2
RF_D1: length 3.3
  Top Layer w0.61: P9.4 50.67,54.1 R21.2
RF_D2: length 3.5
  Top Layer w0.61: R22.2 48.64,53.59 P9.5
RF_D3: length 2.5
  Top Layer w0.61: 41.77,55.37 P9.6
SWCLK: length 23.1
  Top Layer w0.482: U1.24 52.2,46.23 59.31,53.34 69.34,53.34 69.98,53.98 U2.2
SWDIO: length 28.4
  Top Layer w0.482: U1.23 52.93,45.43 59.82,52.32 73.28,52.32 75.06,54.1 U2.4
SWITCH: length 14.2
  Top Layer w0.508: R11.1 57.79,17.27 61.85,17.27 68.95,10.17 P5.1
WDOG_LED: length 11.7
  Top Layer w0.482: R15.1 39.24,52.32 40.01,51.56 45.36,51.56 45.92,51.01 U1.30
ZONE_1: length 7
  Top Layer w0.508: R1.1 37.45,14.66 38.47,13.65 P1.1
ZONE_2: length 8.4
  Top Layer w0.508: P1.3 48.63,11.11 44.31,15.42 R3.1
ZONE_3: length 9.7
  Top Layer w0.508: R5.1 47.11,16.14 53.16,10.09 P2.1
ZONE_4: length 13.8
  Top Layer w0.508: P2.3 63.87,12.46 60.58,15.75 55.5,15.75 54.54,16.7 R7.1
ZONE_STATUS: length 5.8
  Top Layer w0.482: R13.1 76.06,23.12 P4.1
$1N2276: length 5.2
  Top Layer w0.482: 31.37,54.58 31.59,54.36 R14.2
$1N2278: length 10.6
  Top Layer w0.482: LED2.1 27.64,54.53 29.84,52.32 R15.2
$1N5420: length 11.4
  Top Layer w0.482: R19.2 30.1,50.29 27.3,53.09 25.27,53.09 23.83,54.53 LED3.1
$1N9908: length 2.9
  Top Layer w2.032: 5.97,21.5 5.97,18.84 U6.1
$2N1215: length 3.8
  Top Layer w0.61: 64.9,21.09 R9.2
  Top Layer w0.762: D9.3 64.64,20.32
$2N1227: length 1.8
  Top Layer w0.508: D10.1 57.77,18.8 R11.2
$2N1236: length 2.1
  Top Layer w0.508: R1.2 D1.1
$2N1237: length 9.4
  Top Layer w0.508: 37.47,26.42 R2.1 D1.2 37.76,22.69 38.61,21.84 38.61,19.81 39.2,19.22 40.5,19.22
$2N1245: length 7.7
  Top Layer w0.508: 44.31,24.66 D3.2 ; 44.31,24.66 R4.1 ; 44.31,24.66 43.46,23.81 41.02,23.81 40.76,23.54
$2N1246: length 2.1
  Top Layer w0.508: R3.2 D3.1
$2N1251: length 2.4
  Top Layer w0.508: R7.2 D7.1
$2N1257: length 9.5
  Top Layer w0.508: D6.3 50.28,19.09 48.98,19.09 48.39,19.69 48.39,21.41 D5.2 R6.1
$2N1258: length 2.1
  Top Layer w0.508: R5.2 D5.1
$2N1261: length 6.5
  Top Layer w0.508: 51.93,25.31 R8.1 ; 51.93,25.31 D8.3 ; 51.93,25.31 51.93,25.23 D7.2
$2N2416: length 16.3
  Top Layer w0.762: R28.2 78.91,29.98 75.06,29.98 BUZZER1.2 74.46,30.58 D13.2
$2N2418: length 1.8
  Top Layer w0.762: Q1.3 82.17,34.75
$2N2519: length 4.8
  Top Layer w0.762: R30.1 83.18,38.61 83.17,38.59 Q1.1
  Top Layer w0.864: Q1.1 83.12,39.19 81.66,40.65
$2N2755: length 10.3
  Top Layer w0.61: 33.91,29.13 35.64,30.86 42.92,30.86 43.05,31 R33.1
$2N3005: length 13.4
  Top Layer w1.016: 29.49,22.64 29.49,19.96 27.28,17.75 P6.2
$2N3012: length 8.5
  Top Layer w1.016: D14.1 30.23,16.76 31.11,15.88 31.11,11.35 P6.1
$2N3324: length 8.3
  Top Layer w1.016: D15.1 20.95,16.76 21.72,16 21.72,10.62 P7.1
$2N3330: length 14.7
  Top Layer w1.016: 22.99,22.18 22.69,22.18 17.12,16.61 P7.2
$2N3341: length 7.3
  Top Layer w0.762: R35.1 28.66,32.51 25.27,29.13 Q3.1

## Copper pours and planes (outline as drawn; the poured copper is in the pictures)
+5V on Top Layer: 10.54,46.99 11.18,47.62 15.62,47.62 16.51,46.74 16.51,43.81 17.14,43.18 19.61,43.18 19.82,42.96 19.82,33.03 18.67,32 18.54,31.88 18.54,31.11 18.03,30.61 11.8,30.61 11.05,31.35 11.05,33.4 10.54,33.91 10.54,46.99
+12V on Top Layer: 17.91,27.18 17.91,23.88 17.65,23.62 2.29,23.62 1.78,24.13 1.78,47.12 2.29,47.62 8.89,47.62 9.14,47.37 9.14,28.32 9.91,27.56 17.53,27.56
GND on Bottom Layer: 0.38,58.55 85.22,58.55 85.22,0.38 0.38,0.38
VCC on Top Layer: 38.99,42.67 38.99,38.35 30.86,38.35 30.86,40.51 22.99,40.51 20.95,42.56 20.83,46.22 19.43,47.62 16.89,47.62 14.99,49.53 14.86,49.53 14.86,57.15 15.62,57.91 19.56,57.91 20.32,57.53 20.32,53.4 20.65,53.09 23.06,53.09 24,52.2 26.54,52.2 29.46,49.28 32.13,49.28 32.64,48.77 32.64,45.85 32,45.21 29.84,45.21 29.59,44.96 29.59,43.05 29.97,42.67

## Text on the board
Top Silkscreen Layer: W-DOG | CONNECT | BUS | 433MHZ | + | CLK | - | DIO | D | RST | CK | TX | RX | B-TOOTH | ZN | ARM- | LED | RF | +- | + FLASH | I2C-BUS | SW C AD | IN+12V- | -SIR+ | -PGM+ | Z1 C Z2 Z3 C Z4
